# EAGLE schematic hw_DAA (EAGLE 7.6.0), part 1 of 4

## Sheet 1 of 34: Block Diagram
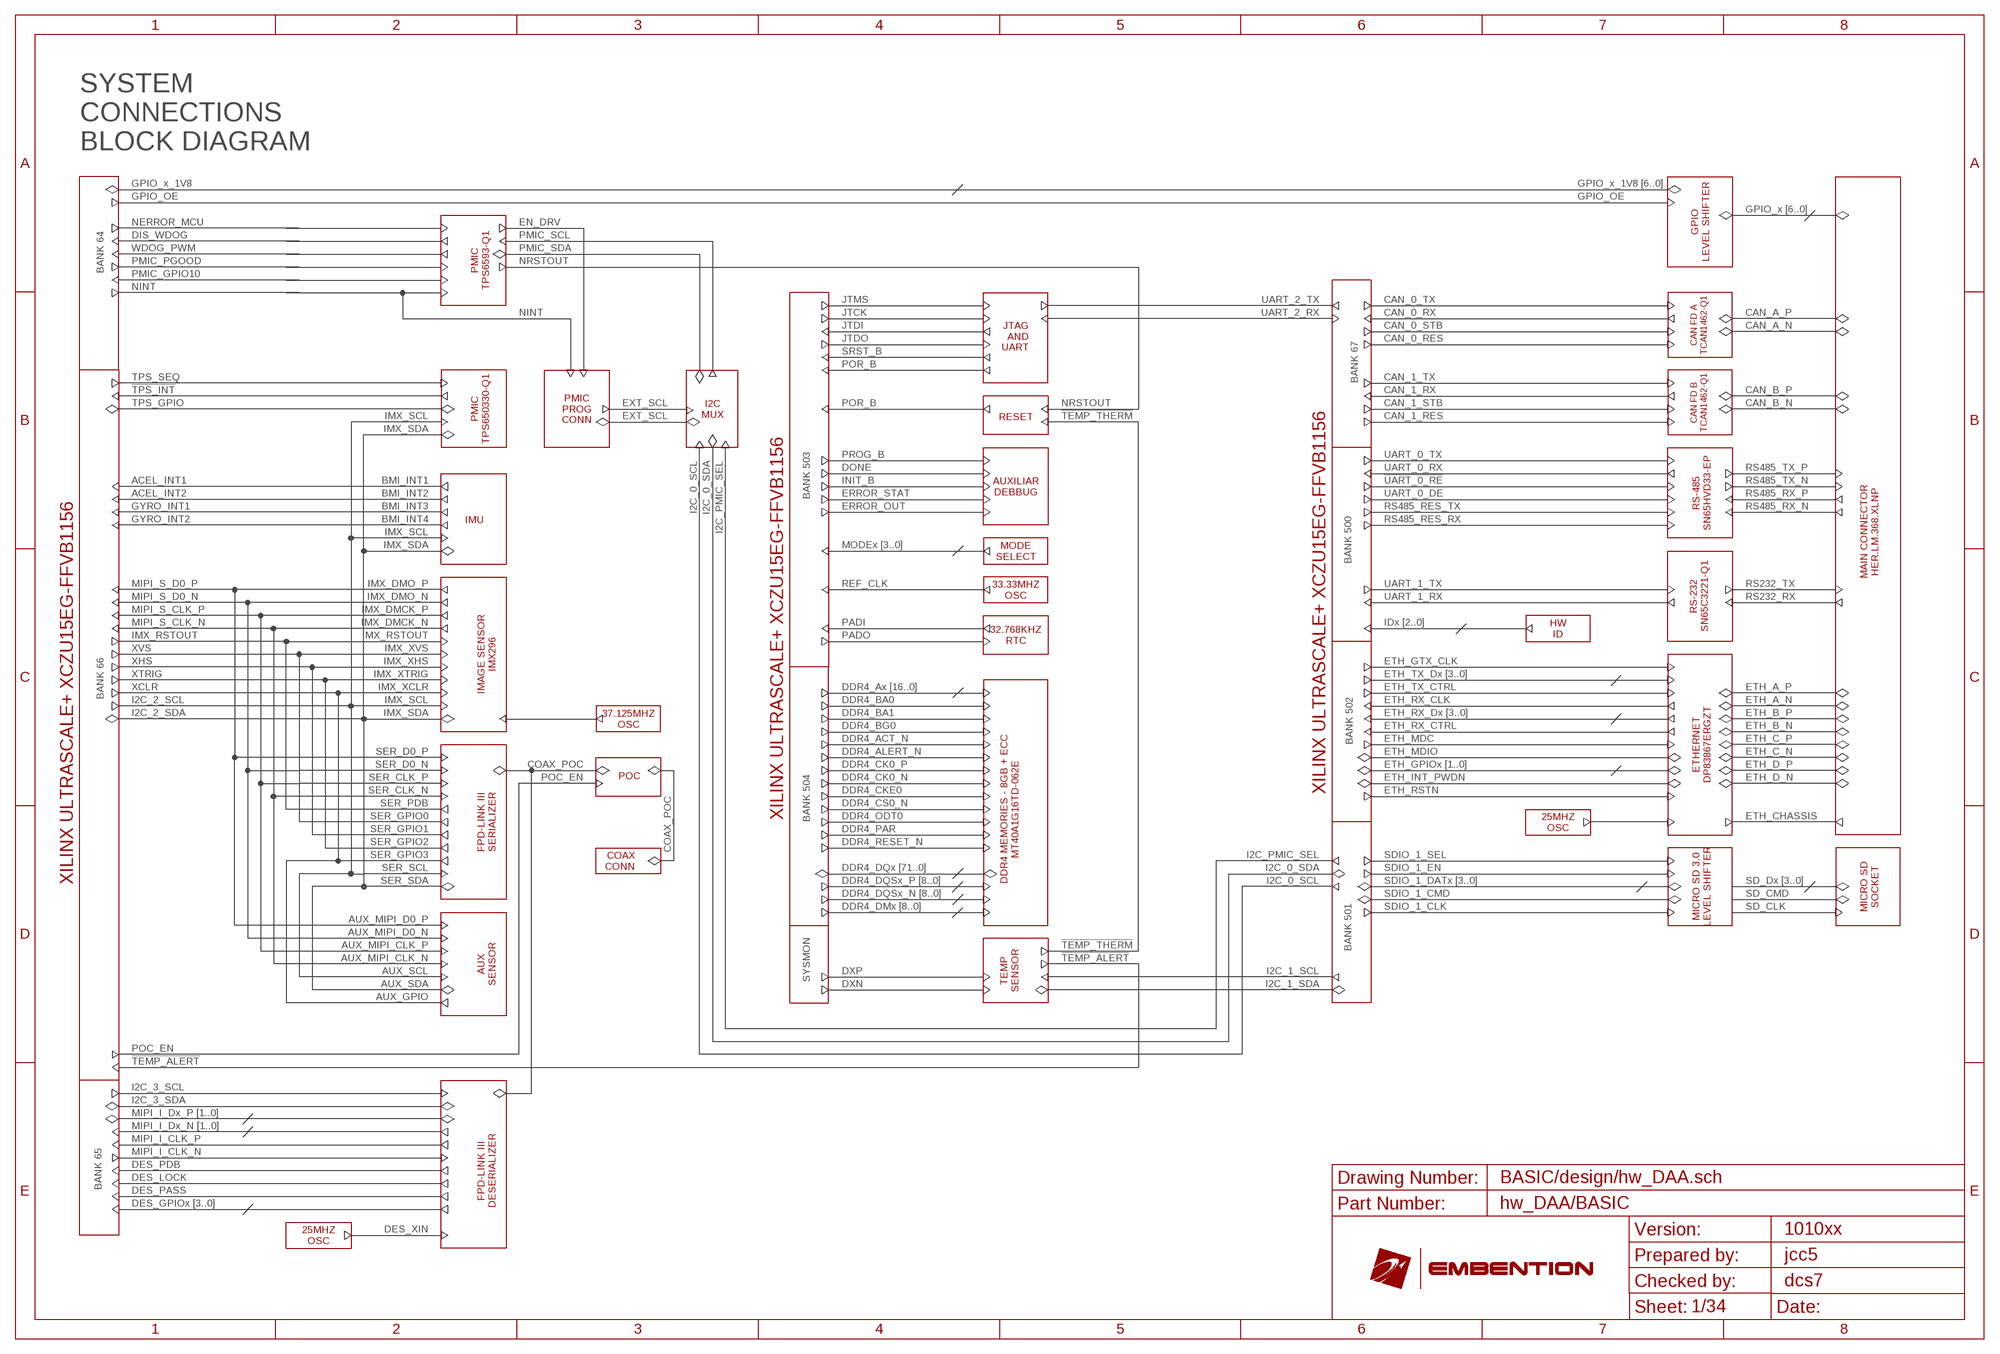
[diagram p0: schematic, sheet 1]

### Notes on the sheet
- SYSTEM
  CONNECTIONS
  BLOCK DIAGRAM
- GPIO_x_1V8 | GPIO_x_1V8 [6..0]
- GPIO_OE | GPIO_OE
- GPIO_x [6..0]
- GPIO
  LEVEL SHIFTER
- NERROR_MCU | EN_DRV
- DIS_WDOG | PMIC_SCL
- WDOG_PWM | PMIC_SDA
- PMIC
  TPS6593-Q1
- PMIC_PGOOD | NRSTOUT
- BANK 64
- PMIC_GPIO10
- NINT
- JTMS | UART_2_TX | CAN_0_TX
- NINT | JTCK | UART_2_RX | CAN_0_RX | CAN_A_P
- CAN FD A
  TCAN1462-Q1
- JTDI | CAN_0_STB | CAN_A_N
- JTDO | CAN_0_RES
- JTAG
  AND
  UART
- SRST_B
- POR_B
- TPS_SEQ | BANK 67 | CAN_1_TX
- !TPS_INT | CAN_1_RX | CAN_B_P
- CAN FD B
  TCAN1462-Q1
- TPS_GPIO | EXT_SCL | POR_B | NRSTOUT | CAN_1_STB | CAN_B_N
- PMIC
  TPS650330-Q1
- PMIC
  PROG
  CONN
- I2C
  MUX
- IMX_SCL | EXT_SCL | RESET | !TEMP_THERM | CAN_1_RES
- IMX_SDA
- I2C_0_SCL | I2C_0_SDA | I2C_PMIC_SEL | PROG_B | UART_0_TX
- DONE | UART_0_RX | RS485_TX_P
- ACEL_INT1 | BMI_INT1 | INIT_B | !UART_0_RE | RS485_TX_N
- AUXILIAR
  DEBBUG
- RS-485
  SN65HVD33-EP
- ACEL_INT2 | BMI_INT2 | BANK 503 | ERROR_STAT | UART_0_DE | RS485_RX_P
- GYRO_INT1 | BMI_INT3 | ERROR_OUT | RS485_RES_TX | RS485_RX_N
- IMU
- GYRO_INT2 | BMI_INT4 | RS485_RES_RX
- MAIN CONNECTOR
  HER.LM.368.XLNP
- IMX_SCL
- IMX_SDA | MODEx [3..0]
- MODE
  SELECT
- BANK 500
- MIPI_S_D0_P | IMX_DMO_P | REF_CLK | UART_1_TX | RS232_TX
- 33.33MHZ
  OSC
- RS-232
  SN65C3221-Q1
- MIPI_S_D0_N | IMX_DMO_N | XILINX ULTRASCALE+ XCZU15EG-FFVB1156 | UART_1_RX | RS232_RX
- MIPI_S_CLK_P | IMX_DMCK_P
- MIPI_S_CLK_N | IMX_DMCK_N | XILINX ULTRASCALE+ XCZU15EG-FFVB1156 | PADI | IDx [2..0]
- HW
  ID
- 32.768KHZ
  RTC
- IMX_RSTOUT | IMX_RSTOUT | PADO
- XVS | IMX_XVS
- IMAGE SENSOR
  IMX296
- XHS | IMX_XHS | ETH_GTX_CLK
- XTRIG | IMX_XTRIG | ETH_TX_Dx [3..0]
- XILINX ULTRASCALE+ XCZU15EG-FFVB1156 | XCLR | IMX_XCLR | DDR4_Ax [16..0] | ETH_TX_CTRL | ETH_A_P
- BANK 66
- I2C_2_SCL | IMX_SCL | DDR4_BA0 | ETH_RX_CLK | ETH_A_N
- I2C_2_SDA | IMX_SDA | DDR4_BA1 | ETH_RX_Dx [3..0] | ETH_B_P
- 37.125MHZ
  OSC
- DDR4_BG0 | ETH_RX_CTRL | ETH_B_N
- DDR4_ACT_N | BANK 502 | ETH_MDC | ETH_C_P
- ETHERNET
  DP83867ERGZT
- SER_D0_P | DDR4_ALERT_N | ETH_MDIO | ETH_C_N
- SER_D0_N | COAX_POC | DDR4_CK0_P | ETH_GPIOx [1..0] | ETH_D_P
- SER_CLK_P | POC_EN | POC | DDR4_CK0_N | ETH_INT_PWDN | ETH_D_N
- SER_CLK_N | COAX_POC | DDR4_CKE0 | ETH_RSTN
- SER_PDB | DDR4_CS0_N
- DDR4 MEMORIES - 8GB + ECC
  MT40A1G16TD-062E
- SER_GPIO0 | DDR4_ODT0 | ETH_CHASSIS
- FPD-LINK III
  SERIALIZER
- BANK 504
- 25MHZ
  OSC
- SER_GPIO1 | DDR4_PAR
- SER_GPIO2 | DDR4_RESET_N
- COAX
  CONN
- SER_GPIO3 | I2C_PMIC_SEL | SDIO_1_SEL
- SER_SCL | DDR4_DQx [71..0] | I2C_0_SDA | SDIO_1_EN
- SER_SDA | DDR4_DQSx_P [8..0] | I2C_0_SCL | SDIO_1_DATx [3..0] | SD_Dx [3..0]
- MICRO SD 3.0
  LEVEL SHIFTER
- MICRO SD
  SOCKET
- DDR4_DQSx_N [8..0] | SDIO_1_CMD | SD_CMD
- DDR4_DMx [8..0] | SDIO_1_CLK | SD_CLK
- AUX_MIPI_D0_P
- AUX_MIPI_D0_N
- AUX_MIPI_CLK_P | !TEMP_THERM | BANK 501
- AUX_MIPI_CLK_N | !TEMP_ALERT
- AUX
  SENSOR
- TEMP
  SENSOR
- AUX_SCL | DXP | I2C_1_SCL
- SYSMON
- AUX_SDA | DXN | I2C_1_SDA
- AUX_GPIO
- POC_EN
- !TEMP_ALERT
- I2C_3_SCL
- I2C_3_SDA
- MIPI_I_Dx_P [1..0]
- MIPI_I_Dx_N [1..0]
- MIPI_I_CLK_P
- MIPI_I_CLK_N
- DES_PDB
- FPD-LINK III
  DESERIALIZER
- DES_LOCK | BASIC/design/hw_DAA.sch
- BANK 65
- DES_PASS
- DES_GPIOx [3..0] | hw_DAA/BASIC
- DES_XIN
- 25MHZ
  OSC
- 1010xx
- jcc5
- dcs7

## Sheet 2 of 34: Connectors
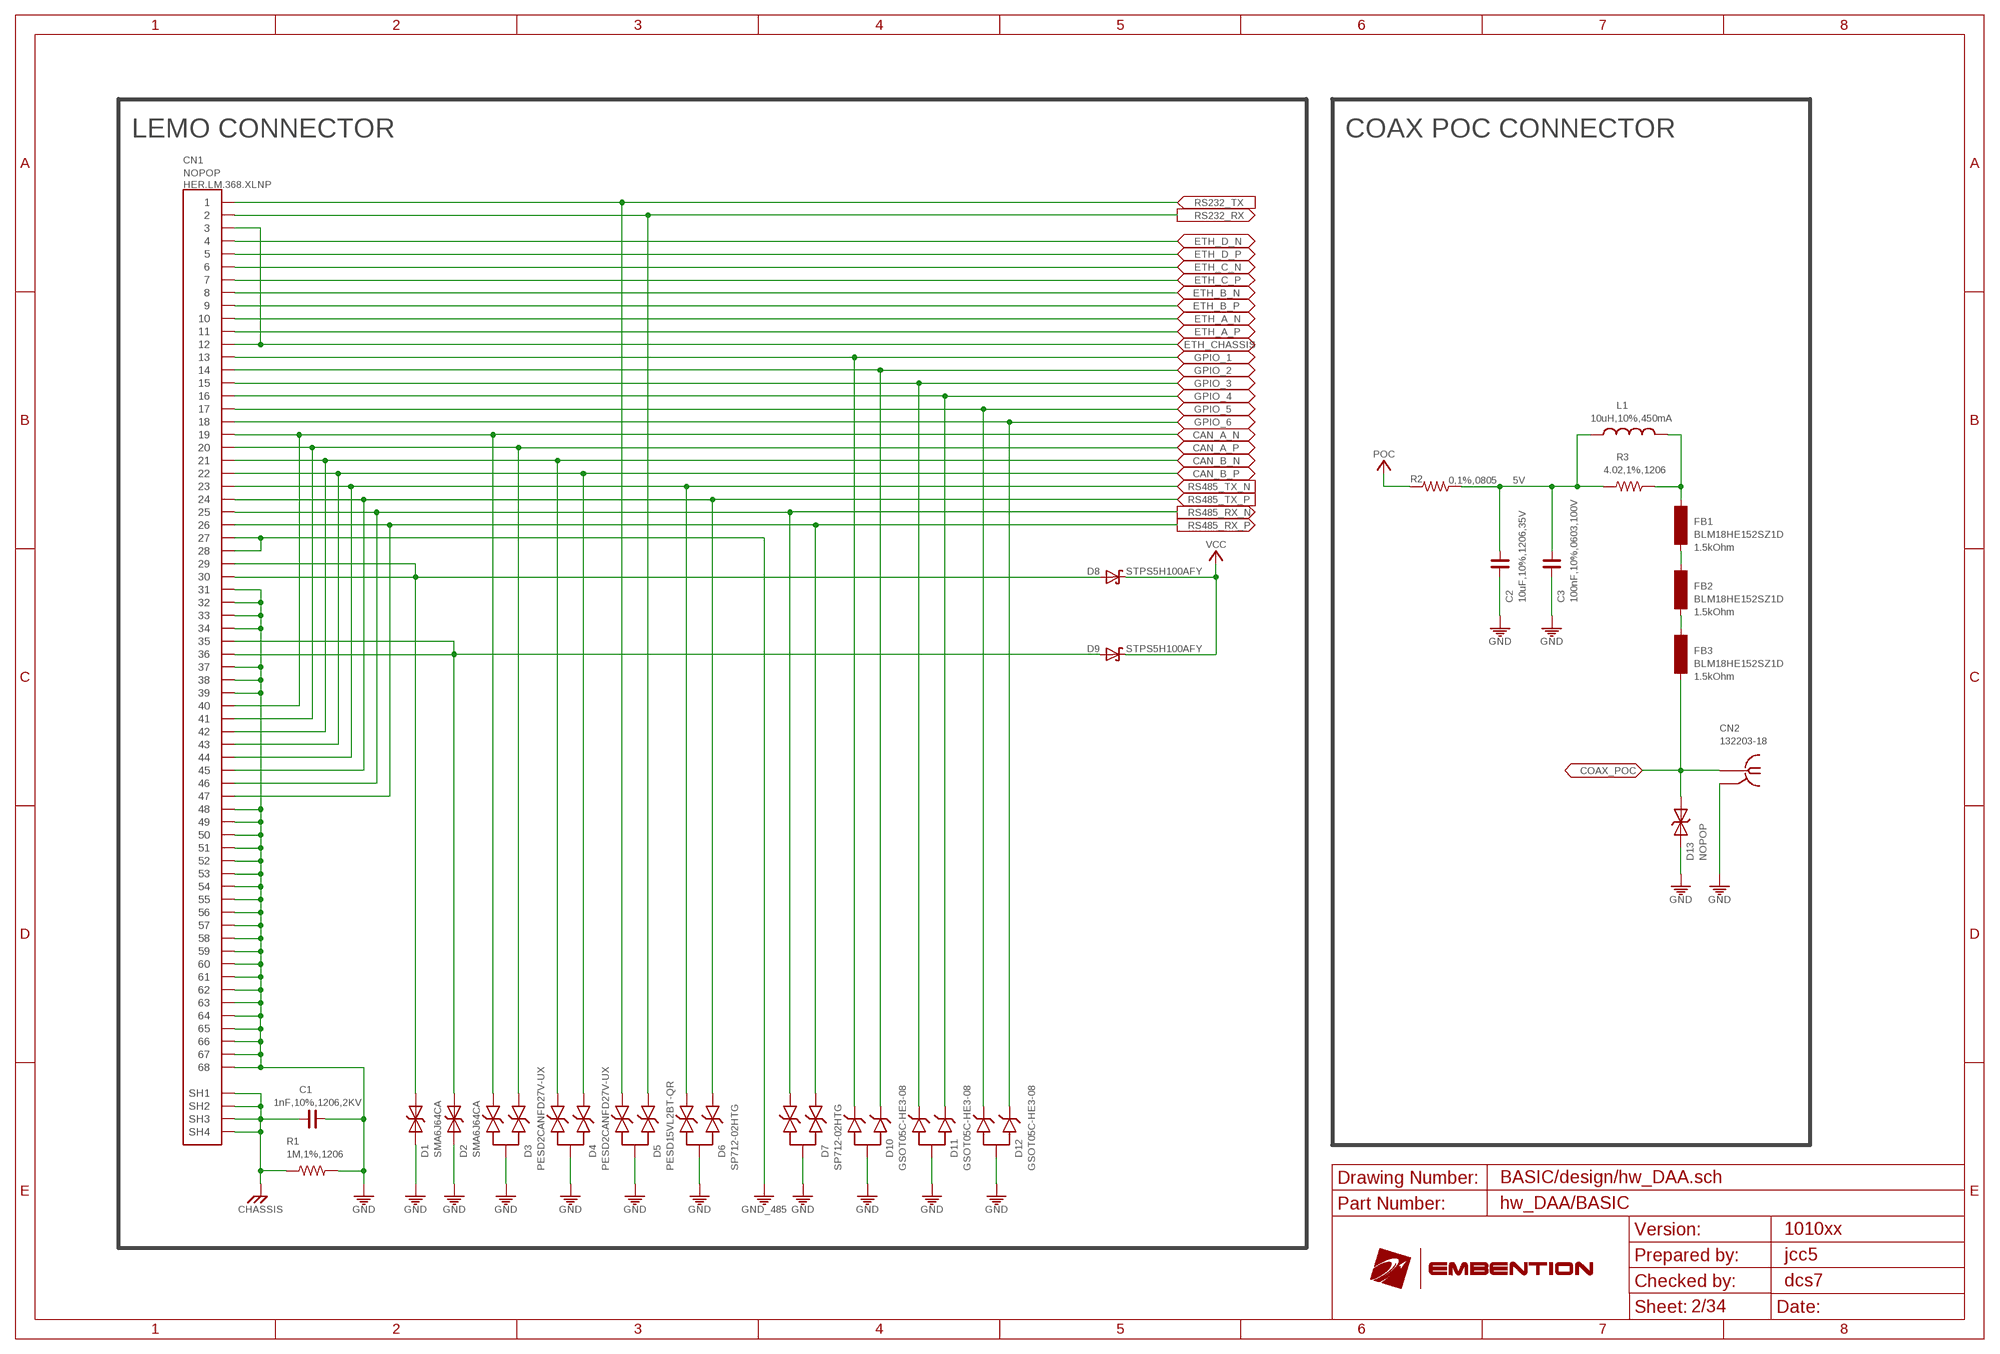
[diagram p1: schematic, sheet 2]

### Parts
C1  1nF,10%,1206,2KV  C_1206  [C1206]
C2  10uF,10%,1206,35V  C_1206  [C1206]
C3  100nF,10%,0603,100V  C_0603  [C0603]
CN1  NOPOP  HEW.LM.368.XLNP  [HEW.LM.368.XLNP]
CN2  132203-18  [132203-18]
D1  SMA6J64CA  SZ1SMA36CAT3G  [SMA_BI]
D2  SMA6J64CA  SZ1SMA36CAT3G  [SMA_BI]
D3  PESD2CANFD27V-UX  [SOT323-3]
D4  PESD2CANFD27V-UX  [SOT323-3]
D5  PESD15VL2BT-QR  SP712-02HTG  [SOT-23-3]
D6  SP712-02HTG  [SOT-23-3]
D7  SP712-02HTG  [SOT-23-3]
D8  STPS5H100AFY  PMEG10030ELPX  [SOD128]
D9  STPS5H100AFY  PMEG10030ELPX  [SOD128]
D10  GSOT05C-HE3-08  [SOT-23-3]
D11  GSOT05C-HE3-08  [SOT-23-3]
D12  GSOT05C-HE3-08  [SOT-23-3]
D13  NOPOP  PESD0402-140  [PESD0402-140]
FB1  BLM18HE152SZ1D  [L0603]
FB2  BLM18HE152SZ1D  [L0603]
FB3  BLM18HE152SZ1D  [L0603]
L1  10uH,10%,450mA  NLCV32T-100K-EFRD  [NLCV32T-100K-EFRD]
R1  1M,1%,1206  R_1206  [R1206]
R2  0,1%,0805  R_0805  [R0805]
R3  4.02,1%,1206  R_1206  [R1206]

### Nets
CAN_A_N [DIFF120]: CN1.19 CN1.40 D3.1 ; also sheet 25
CAN_A_P [DIFF120]: CN1.20 CN1.41 D3.2 ; also sheet 25
CAN_B_N [DIFF120]: CN1.21 CN1.42 D4.1 ; also sheet 25
CAN_B_P [DIFF120]: CN1.22 CN1.43 D4.2 ; also sheet 25
CHASSIS: C1.1 CN1.SH1 CN1.SH2 CN1.SH3 CN1.SH4 R1.1 ; also sheet 27
COAX_POC [COAX_50]: CN2.RF D13.P$2 FB3.1 ; also sheet 31,32
ETH_A_N [DIFF100]: CN1.10 ; also sheet 27
ETH_A_P [DIFF100]: CN1.11 ; also sheet 27
ETH_B_N [DIFF100]: CN1.8 ; also sheet 27
ETH_B_P [DIFF100]: CN1.9 ; also sheet 27
ETH_C_N [DIFF100]: CN1.6 ; also sheet 27
ETH_C_P [DIFF100]: CN1.7 ; also sheet 27
ETH_CHASSIS: CN1.3 CN1.12 ; also sheet 27
ETH_D_N [DIFF100]: CN1.4 ; also sheet 27
ETH_D_P [DIFF100]: CN1.5 ; also sheet 27
GND: C1.2 C2.1 C3.1 CN1.31 CN1.32 CN1.33 CN1.34 CN1.37 CN1.38 CN1.39 CN1.48 CN1.49 CN1.50 CN1.51 CN1.52 CN1.53 CN1.54 CN1.55 CN1.56 CN1.57 CN1.58 CN1.59 CN1.60 CN1.61 CN1.62 CN1.63 CN1.64 CN1.65 CN1.66 CN1.67 CN1.68 CN2.GND1(GND) CN2.GND2(GND) CN2.GND3(GND) CN2.GND4(GND) D1.1 D2.1 D3.3 D4.3 D5.3 D6.3 D7.3 D10.3 D11.3 D12.3 D13.P$1 R1.2 ; also sheet 3,4,5,6,7,8,9,10,11,12,13,14,15,17,18,20,21,22,23,24,25,26,27,28,29,30,31,32,33
GND_485: CN1.27 CN1.28 ; also sheet 26
GPIO_1: CN1.13 D10.1 ; also sheet 33
GPIO_2: CN1.14 D10.2 ; also sheet 33
GPIO_3: CN1.15 D11.1 ; also sheet 33
GPIO_4: CN1.16 D11.2 ; also sheet 33
GPIO_5: CN1.17 D12.1 ; also sheet 33
GPIO_6: CN1.18 D12.2 ; also sheet 33
N$57: C2.2 C3.2 L1.1 R2.1 R3.1
N$80: FB1.1 FB2.2
N$87: FB1.2 L1.2 R3.2
N$89: FB2.1 FB3.2
POC: R2.2 ; also sheet 3,9
RS232_RX: CN1.2 D5.2 ; also sheet 26
RS232_TX: CN1.1 D5.1 ; also sheet 26
RS485_RX_N [DIFF120]: CN1.25 CN1.46 D7.1 ; also sheet 26
RS485_RX_P [DIFF120]: CN1.26 CN1.47 D7.2 ; also sheet 26
RS485_TX_N [DIFF120]: CN1.23 CN1.44 D6.1 ; also sheet 26
RS485_TX_P [DIFF120]: CN1.24 CN1.45 D6.2 ; also sheet 26
VCC: D8.K(C) D9.K(C) ; also sheet 3
VIN_1: CN1.29 CN1.30 D1.2 D8.A
VIN_2: CN1.35 CN1.36 D2.2 D9.A

### Notes on the sheet
- LEMO CONNECTOR | COAX POC CONNECTOR
- HER.LM.368.XLNP
- 5V
- 1.5kOhm
- 1.5kOhm
- 1.5kOhm
- BASIC/design/hw_DAA.sch
- hw_DAA/BASIC
- 1010xx
- jcc5
- dcs7

## Sheet 3 of 34: +5V Power Supply
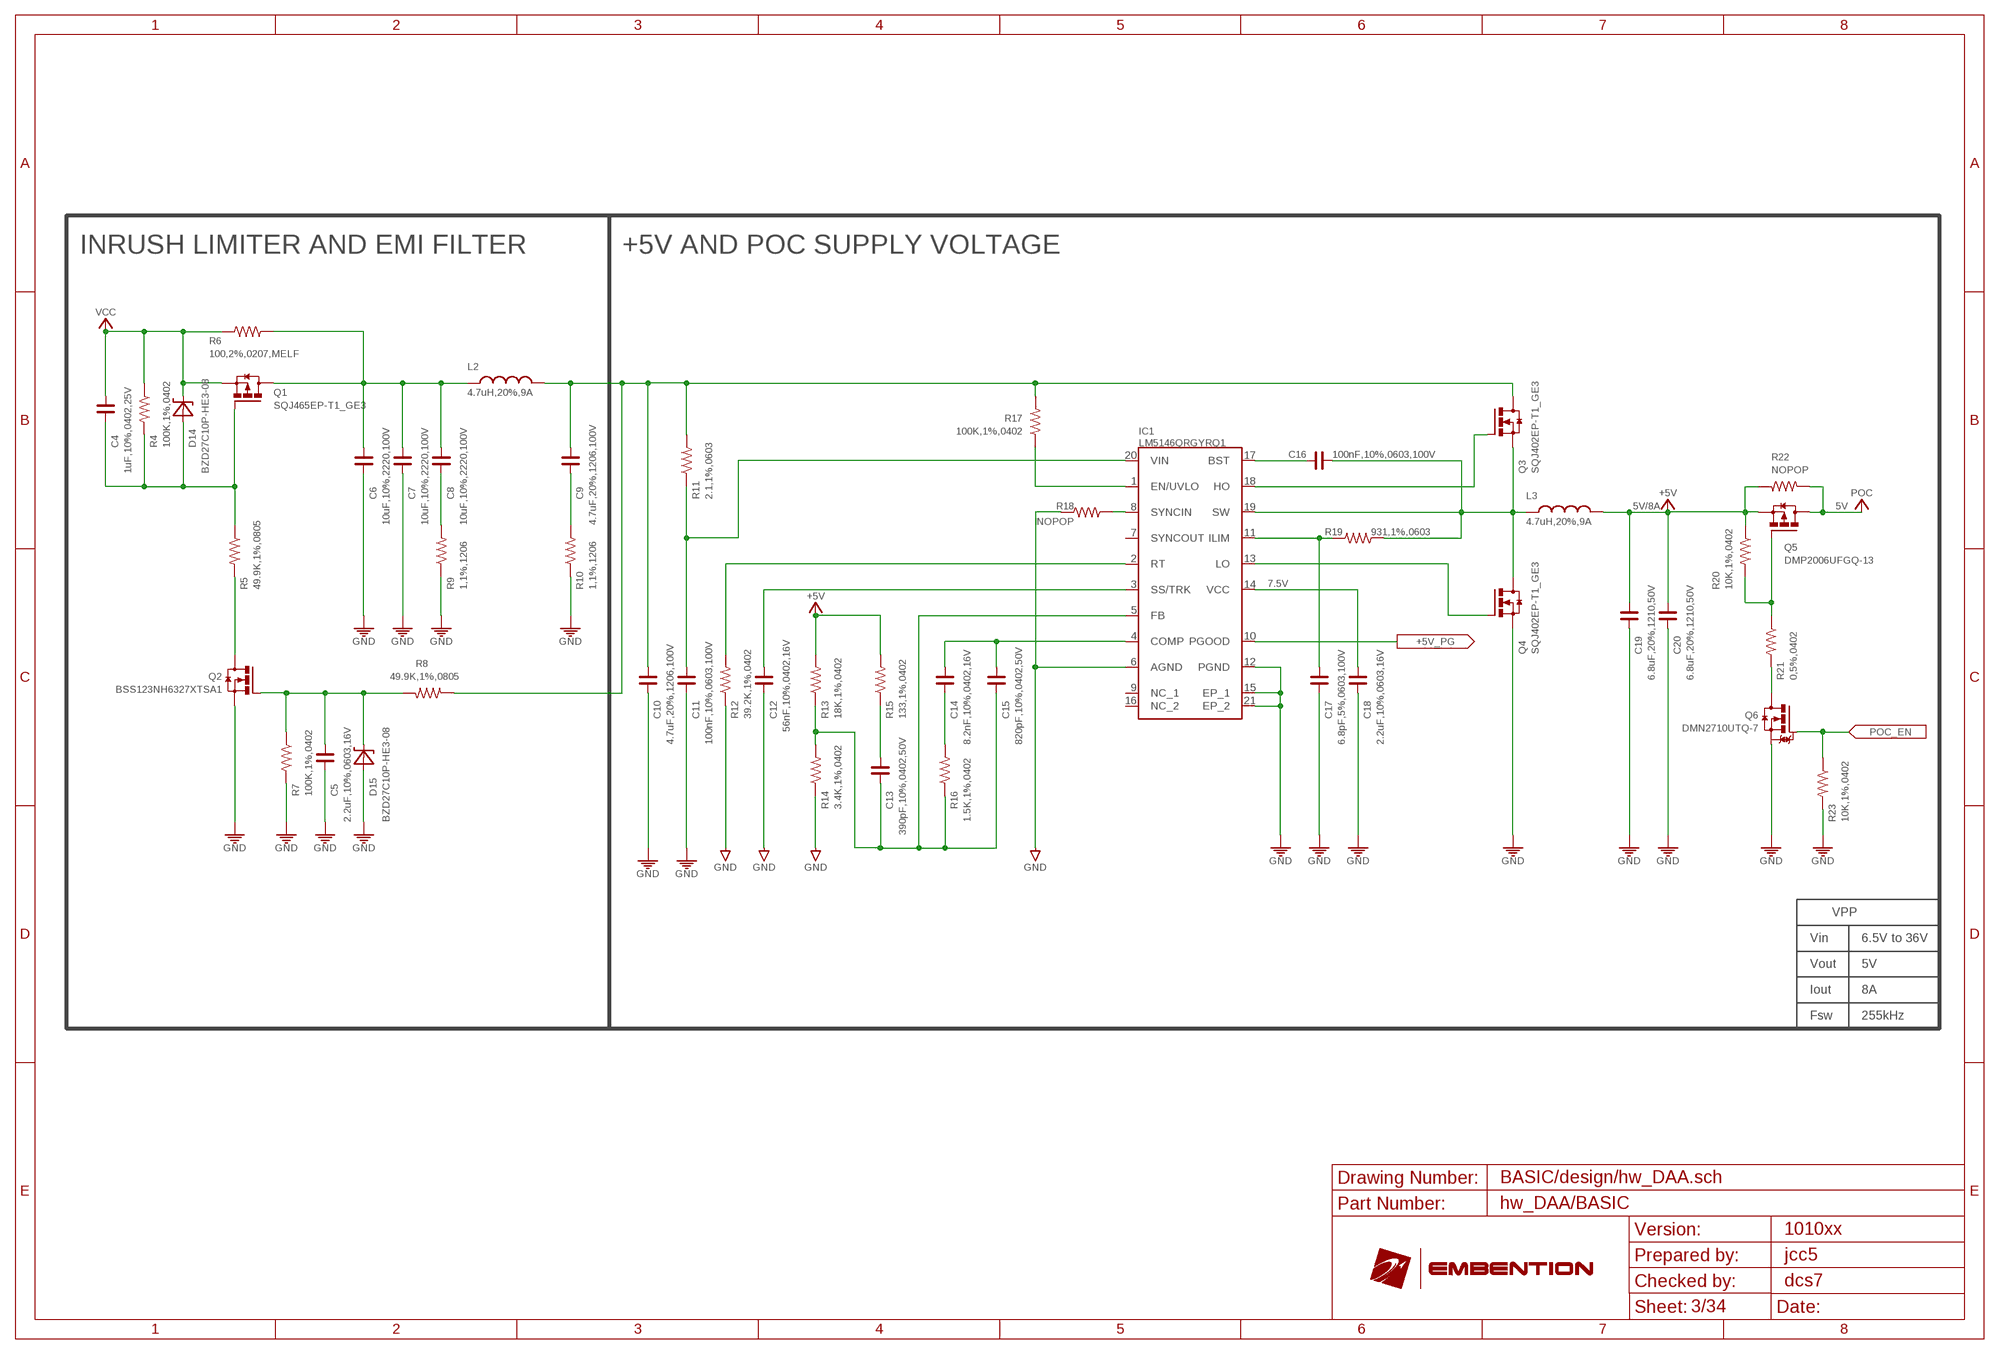
[diagram p2: schematic, sheet 3]

### Parts
C4  1uF,10%,0402,25V  C_0402  [C0402]
C5  2.2uF,10%,0603,16V  C_0603  [C0603]
C6  10uF,10%,2220,100V  C_2220K  [C2220K]
C7  10uF,10%,2220,100V  C_2220K  [C2220K]
C8  10uF,10%,2220,100V  C_2220K  [C2220K]
C9  4.7uF,20%,1206,100V  C_1206  [C1206]
C10  4.7uF,20%,1206,100V  C_1206  [C1206]
C11  100nF,10%,0603,100V  C_0603  [C0603]
C12  56nF,10%,0402,16V  C_0402  [C0402]
C13  390pF,10%,0402,50V  C_0402  [C0402]
C14  8.2nF,10%,0402,16V  C_0402  [C0402]
C15  820pF,10%,0402,50V  C_0402  [C0402]
C16  100nF,10%,0603,100V  C_0603  [C0603]
C17  6.8pF,5%,0603,100V  C_0603  [C0603]
C18  2.2uF,10%,0603,16V  C_0603  [C0603]
C19  6.8uF,20%,1210,50V  C_1210  [C1210]
C20  6.8uF,20%,1210,50V  C_1210  [C1210]
D14  BZD27C10P-HE3-08  [DO-219AB-2]
D15  BZD27C10P-HE3-08  [DO-219AB-2]
IC1  LM5146QRGYRQ1  LM5146-Q1  [VQFN-20]
L2  4.7uH,20%,9A  XAL7030472  [XAL7030-472]
L3  4.7uH,20%,9A  XAL7030472  [XAL7030-472]
Q1  SQJ465EP-T1_GE3  [SO-8L]
Q2  BSS123NH6327XTSA1  [SOT23-3]
Q3  SQJ402EP-T1_GE3  [SO-8L]
Q4  SQJ402EP-T1_GE3  [SO-8L]
Q5  DMP2006UFGQ-13  [POWERDI3333-8]
Q6  DMN2710UTQ-7  [SOT-523]
R4  100K,1%,0402  R_0402  [R0402]
R5  49.9K,1%,0805  R_0805  [R0805]
R6  100,2%,0207,MELF  R_0207  [MELF0207]
R7  100K,1%,0402  R_0402  [R0402]
R8  49.9K,1%,0805  R_0805  [R0805]
R9  1,1%,1206  R_1206  [R1206]
R10  1,1%,1206  R_1206  [R1206]
R11  2.1,1%,0603  R_0603  [R0603]
R12  39.2K,1%,0402  R_0402  [R0402]
R13  18K,1%,0402  R_0402  [R0402]
R14  3.4K,1%,0402  R_0402  [R0402]
R15  133,1%,0402  R_0402  [R0402]
R16  1.5K,1%,0402  R_0402  [R0402]
R17  100K,1%,0402  R_0402  [R0402]
R18  NOPOP  R_0402  [R0402]
R19  931,1%,0603  R_0603  [R0603]
R20  10K,1%,0402  R_0402  [R0402]
R21  0,5%,0402  R_0402  [R0402]
R22  NOPOP  R_0805  [R0805]
R23  10K,1%,0402  R_0402  [R0402]

### Nets
+5V: C19.1 C20.1 L3.2 Q5.1(S) Q5.2(S) Q5.3(S) R13.2 R15.2 R20.1 R22.1 ; also sheet 4,5,7,8,25,26,33
+5V_PG: IC1.10(PGOOD) ; also sheet 4
GND: C5.2 C6.2 C7.2 C10.2 C11.2 C12.2 C17.2 C18.2 C19.2 C20.2 D15.A IC1.6(AGND) IC1.12(PGND) IC1.15(EP_1) IC1.21(EP_2) Q2.2(S) Q4.1(S) Q4.2(S) Q4.3(S) Q6.2(S) R7.2 R9.1 R10.1 R12.1 R14.1 R18.1 R23.2 ; also sheet 2,4,5,6,7,8,9,10,11,12,13,14,15,17,18,20,21,22,23,24,25,26,27,28,29,30,31,32,33
HO: IC1.18(HO) Q3.4(G)
ILIM: C17.1 IC1.11(ILIM) R19.2
LO: IC1.13(LO) Q4.4(G)
N$2: Q5.4(G) R20.2 R21.1
N$43: IC1.2(RT) R12.2
N$45: C12.1 IC1.3(SS/TRK)
N$46: C13.2 C15.2 IC1.5(FB) R13.1 R14.2 R16.1
N$49: C14.2 R16.2
N$50: C16.1 IC1.19(SW) L3.1 Q3.1(S) Q3.2(S) Q3.3(S) Q4.5(D) Q4.EP1(D) Q4.EP2(D) R19.1
N$51: C16.2 IC1.17(BST)
N$52: C9.1 C10.1 L2.2 Q3.5(D) Q3.EP1(D) Q3.EP2(D) R8.1 R11.2 R17.2
N$60: C8.2 R9.2
N$61: C9.2 R10.2
N$63: C18.1 IC1.14(VCC)
N$64: IC1.1(EN/UVLO) R17.1
N$65: IC1.8(SYNCIN) R18.2
N$66: C13.1 R15.1
N$69: C11.1 IC1.20(VIN) R11.1
N$70: C4.2 D14.A Q1.4(G) R4.2 R5.1
N$83: C6.1 C7.1 C8.1 L2.1 Q1.5(D) Q1.EP1(D) Q1.EP2(D) R6.2
N$110: C14.1 C15.1 IC1.4(COMP)
N$118: Q6.3(D) R21.2
N$173: Q2.3(D) R5.2
N$175: C5.1 D15.K(C) Q2.1(G) R7.1 R8.2
POC: Q5.5(D) Q5.6(D) Q5.7(D) Q5.8(D) Q5.EP(D) R22.2 ; also sheet 2,9
POC_EN: Q6.1(G) R23.1 ; also sheet 17
VCC: C4.1 D14.K(C) Q1.1(S) Q1.2(S) Q1.3(S) R4.1 R6.1 ; also sheet 2
Unconnected: IC1.7(SYNCOUT) IC1.9(NC_1) IC1.16(NC_2)

### Notes on the sheet
- INRUSH LIMITER AND EMI FILTER | +5V AND POC SUPPLY VOLTAGE
- 5V/8A | 5V
- 7.5V
- VPP
- Vin | 6.5V to 36V
- Vout | 5V
- Iout | 8A
- Fsw | 255kHz
- BASIC/design/hw_DAA.sch
- hw_DAA/BASIC
- 1010xx
- jcc5
- dcs7

## Sheet 4 of 34: VMON Buck
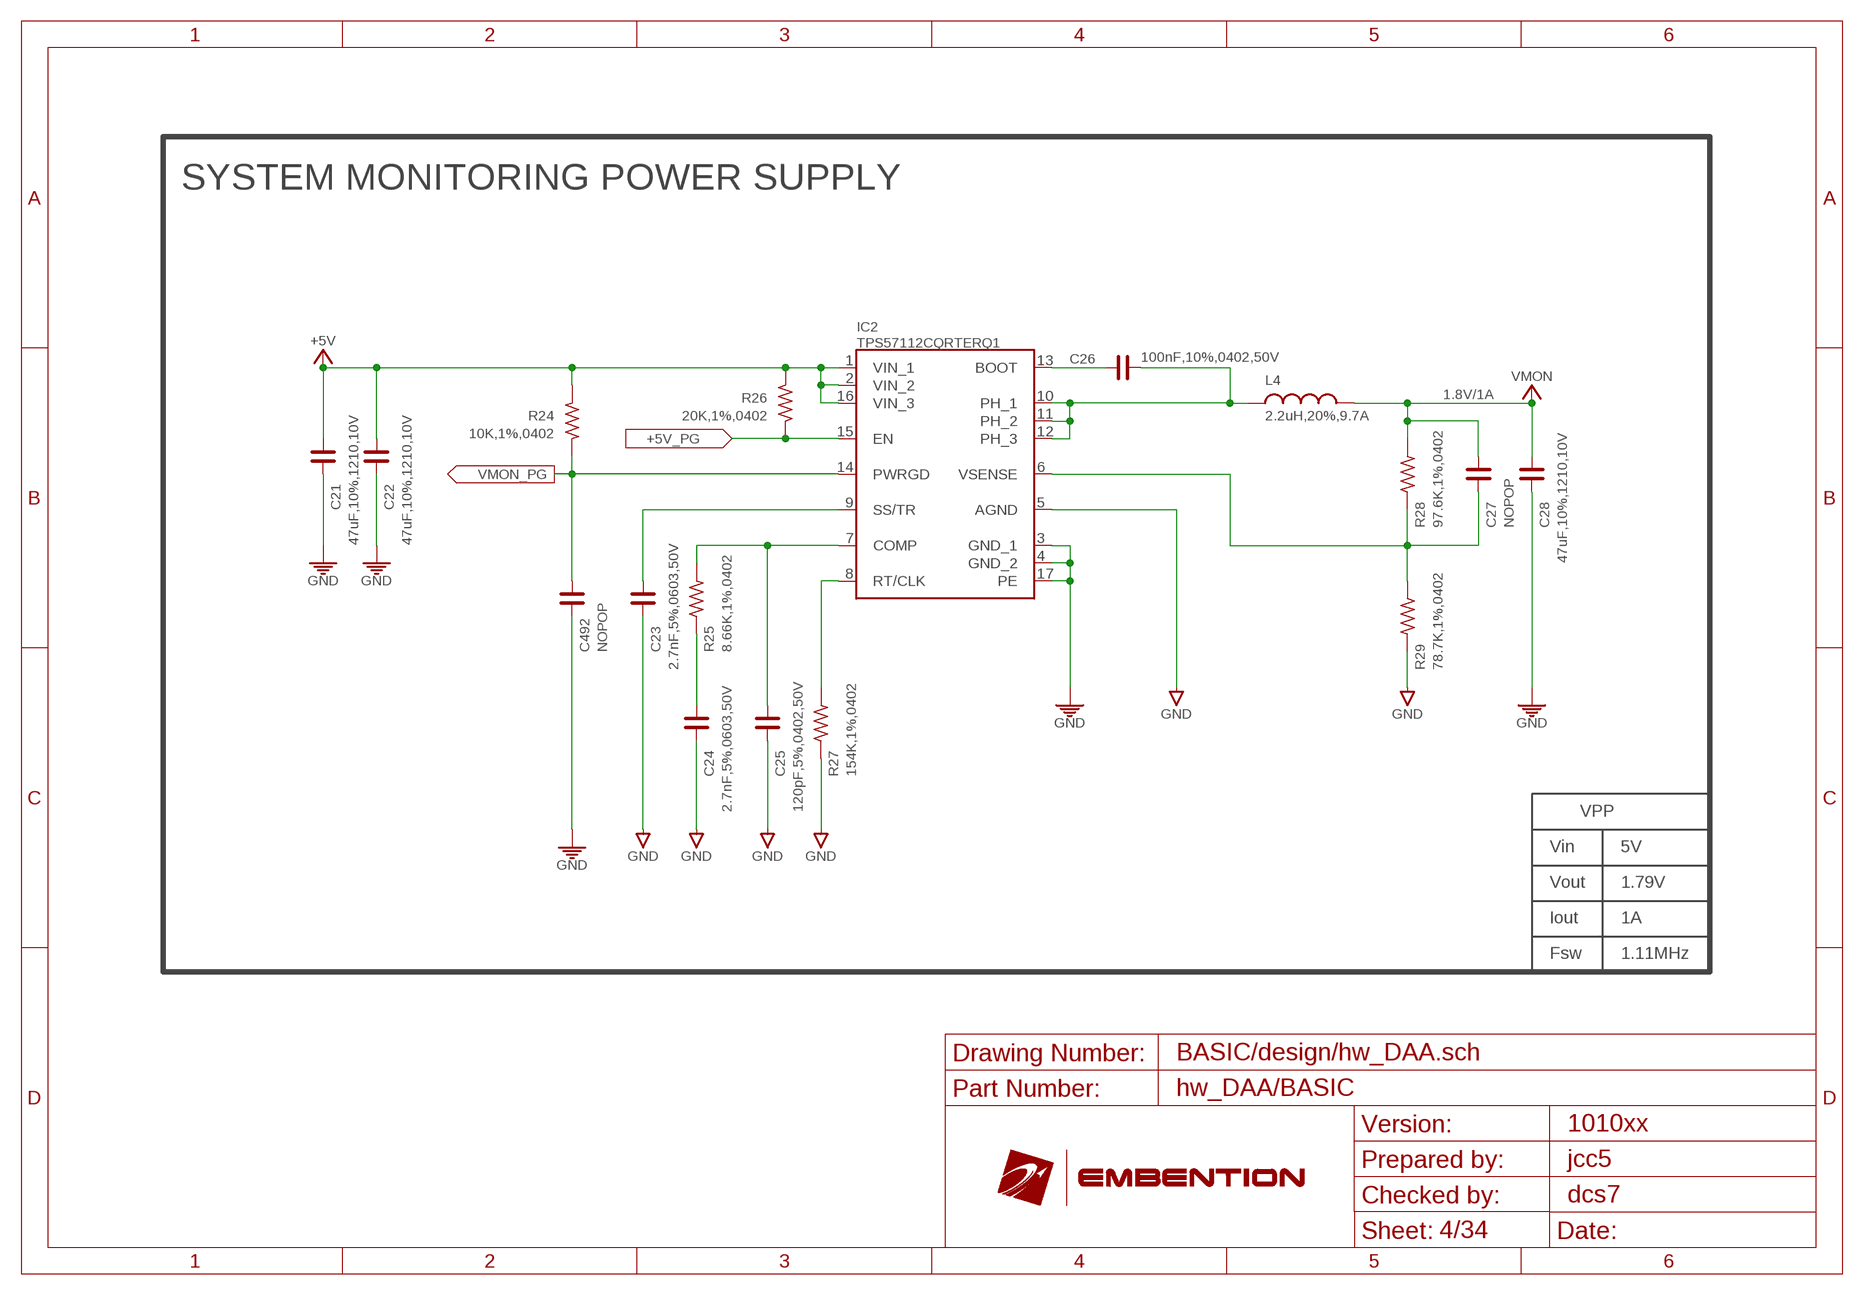
[diagram p3: schematic, sheet 4]

### Parts
C21  47uF,10%,1210,10V  C_1210  [C1210]
C22  47uF,10%,1210,10V  C_1210  [C1210]
C23  2.7nF,5%,0603,50V  C_0603  [C0603]
C24  2.7nF,5%,0603,50V  C_0603  [C0603]
C25  120pF,5%,0402,50V  C_0402  [C0402]
C26  100nF,10%,0402,50V  C_0402  [C0402]
C27  NOPOP  C_0402  [C0402]
C28  47uF,10%,1210,10V  C_1210  [C1210]
C492  NOPOP  C_0402  [C0402]
IC2  TPS57112CQRTERQ1  TPS57112C-Q1  [WQFN-16]
L4  2.2uH,20%,9.7A  XAL50XX  [XAL50XX]
R24  10K,1%,0402  R_0402  [R0402]
R25  8.66K,1%,0402  R_0402  [R0402]
R26  20K,1%,0402  R_0402  [R0402]
R27  154K,1%,0402  R_0402  [R0402]
R28  97.6K,1%,0402  R_0402  [R0402]
R29  78.7K,1%,0402  R_0402  [R0402]

### Nets
+5V: C21.1 C22.1 IC2.1(VIN_1) IC2.2(VIN_2) IC2.16(VIN_3) R24.2 R26.2 ; also sheet 3,5,7,8,25,26,33
+5V_PG: IC2.15(EN) R26.1 ; also sheet 3
GND: C21.2 C22.2 C23.2 C24.2 C25.2 C28.2 C492.2 IC2.3(GND_1) IC2.4(GND_2) IC2.5(AGND) IC2.17(PE) R27.1 R29.1 ; also sheet 2,3,5,6,7,8,9,10,11,12,13,14,15,17,18,20,21,22,23,24,25,26,27,28,29,30,31,32,33
N$77: C23.1 IC2.9(SS/TR)
N$81: C25.1 IC2.7(COMP) R25.2
N$133: C24.1 R25.1
N$135: IC2.8(RT/CLK) R27.2
N$136: C27.2 IC2.6(VSENSE) R28.1 R29.2
N$137: C26.2 IC2.13(BOOT)
N$138: C26.1 IC2.10(PH_1) IC2.11(PH_2) IC2.12(PH_3) L4.1
VMON: C27.1 C28.1 L4.2 R28.2 ; also sheet 5,6,7,8,10
VMON_PG: C492.1 IC2.14(PWRGD) R24.1 ; also sheet 5

### Notes on the sheet
- SYSTEM MONITORING POWER SUPPLY
- 1.8V/1A
- VPP
- Vin | 5V
- Vout | 1.79V
- Iout | 1A
- Fsw | 1.11MHz
- BASIC/design/hw_DAA.sch
- hw_DAA/BASIC
- 1010xx
- jcc5
- dcs7

## Sheet 5 of 34: FPGA and Peripherals PMIC
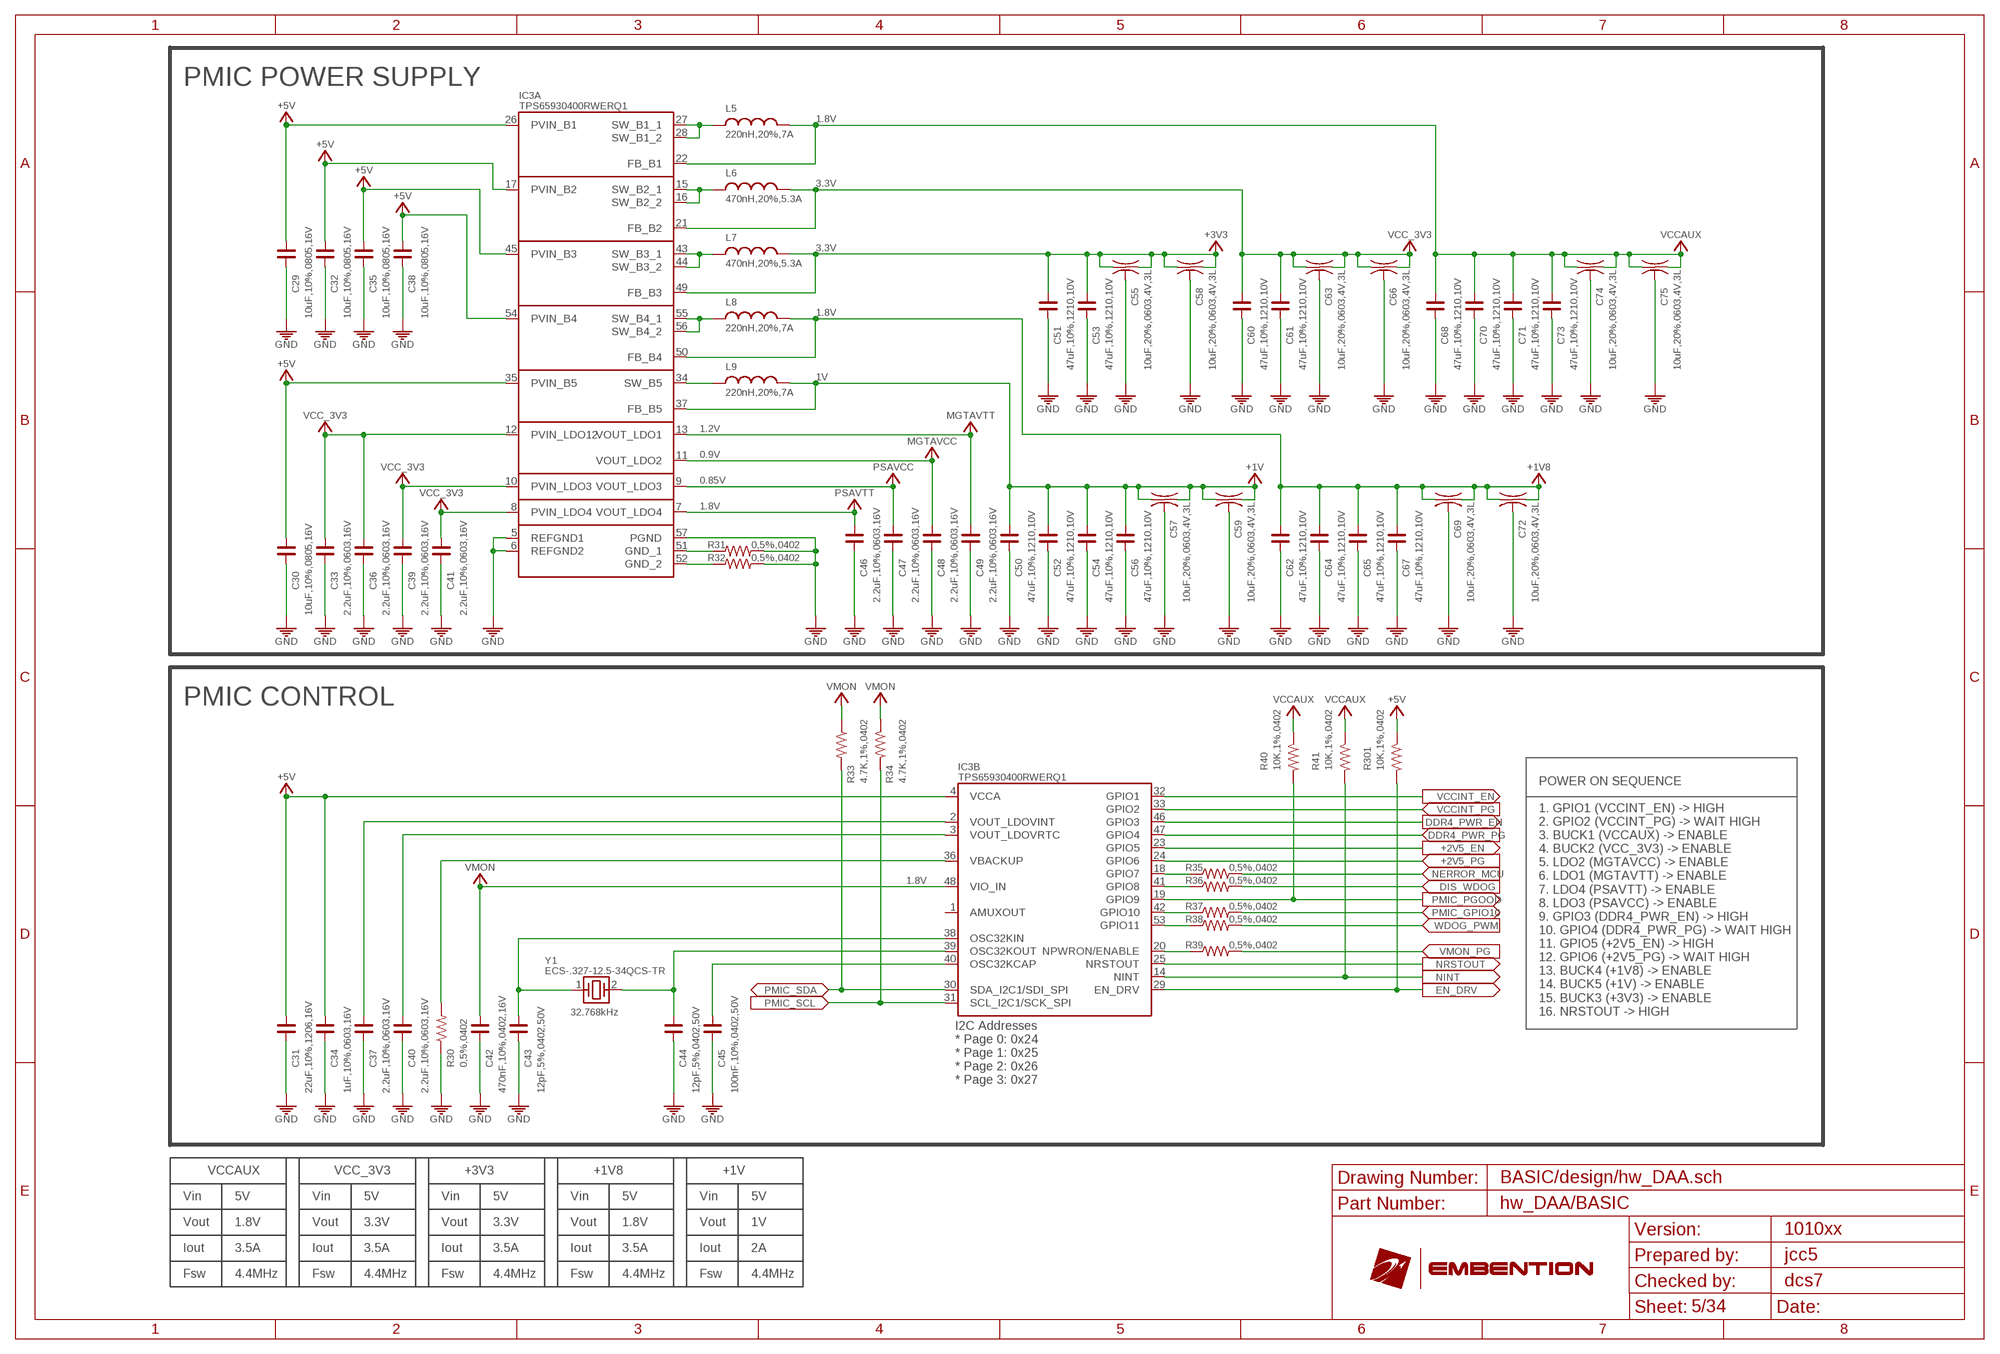
[diagram p4: schematic, sheet 5]

### Parts
C29  10uF,10%,0805,16V  C_0805  [C0805]
C30  10uF,10%,0805,16V  C_0805  [C0805]
C31  22uF,10%,1206,16V  C_1206  [C1206]
C32  10uF,10%,0805,16V  C_0805  [C0805]
C33  2.2uF,10%,0603,16V  C_0603  [C0603]
C34  1uF,10%,0603,16V  C_0603  [C0603]
C35  10uF,10%,0805,16V  C_0805  [C0805]
C36  2.2uF,10%,0603,16V  C_0603  [C0603]
C37  2.2uF,10%,0603,16V  C_0603  [C0603]
C38  10uF,10%,0805,16V  C_0805  [C0805]
C39  2.2uF,10%,0603,16V  C_0603  [C0603]
C40  2.2uF,10%,0603,16V  C_0603  [C0603]
C41  2.2uF,10%,0603,16V  C_0603  [C0603]
C42  470nF,10%,0402,16V  C_0402  [C0402]
C43  12pF,5%,0402,50V  C_0402  [C0402]
C44  12pF,5%,0402,50V  C_0402  [C0402]
C45  100nF,10%,0402,50V  C_0402  [C0402]
C46  2.2uF,10%,0603,16V  C_0603  [C0603]
C47  2.2uF,10%,0603,16V  C_0603  [C0603]
C48  2.2uF,10%,0603,16V  C_0603  [C0603]
C49  2.2uF,10%,0603,16V  C_0603  [C0603]
C50  47uF,10%,1210,10V  C_1210  [C1210]
C51  47uF,10%,1210,10V  C_1210  [C1210]
C52  47uF,10%,1210,10V  C_1210  [C1210]
C53  47uF,10%,1210,10V  C_1210  [C1210]
C54  47uF,10%,1210,10V  C_1210  [C1210]
C55  10uF,20%,0603,4V,3L  NFM18HC106D0G3L  [NFM18HC106]
C56  47uF,10%,1210,10V  C_1210  [C1210]
C57  10uF,20%,0603,4V,3L  NFM18HC106D0G3L  [NFM18HC106]
C58  10uF,20%,0603,4V,3L  NFM18HC106D0G3L  [NFM18HC106]
C59  10uF,20%,0603,4V,3L  NFM18HC106D0G3L  [NFM18HC106]
C60  47uF,10%,1210,10V  C_1210  [C1210]
C61  47uF,10%,1210,10V  C_1210  [C1210]
C62  47uF,10%,1210,10V  C_1210  [C1210]
C63  10uF,20%,0603,4V,3L  NFM18HC106D0G3L  [NFM18HC106]
C64  47uF,10%,1210,10V  C_1210  [C1210]
C65  47uF,10%,1210,10V  C_1210  [C1210]
C66  10uF,20%,0603,4V,3L  NFM18HC106D0G3L  [NFM18HC106]
C67  47uF,10%,1210,10V  C_1210  [C1210]
C68  47uF,10%,1210,10V  C_1210  [C1210]
C69  10uF,20%,0603,4V,3L  NFM18HC106D0G3L  [NFM18HC106]
C70  47uF,10%,1210,10V  C_1210  [C1210]
C71  47uF,10%,1210,10V  C_1210  [C1210]
C72  10uF,20%,0603,4V,3L  NFM18HC106D0G3L  [NFM18HC106]
C73  47uF,10%,1210,10V  C_1210  [C1210]
C74  10uF,20%,0603,4V,3L  NFM18HC106D0G3L  [NFM18HC106]
C75  10uF,20%,0603,4V,3L  NFM18HC106D0G3L  [NFM18HC106]
IC3  TPS65930400RWERQ1  TPS6593-Q1  [VQFN-56]
L5  220nH,20%,7A  TFM322512ALMA  [L1210]
L6  470nH,20%,5.3A  TFM322512ALMA  [L1210]
L7  470nH,20%,5.3A  TFM322512ALMA  [L1210]
L8  220nH,20%,7A  TFM322512ALMA  [L1210]
L9  220nH,20%,7A  TFM322512ALMA  [L1210]
R30  0,5%,0402  R_0402  [R0402]
R31  0,5%,0402  R_0402  [R0402]
R32  0,5%,0402  R_0402  [R0402]
R33  4.7K,1%,0402  R_0402  [R0402]
R34  4.7K,1%,0402  R_0402  [R0402]
R35  0,5%,0402  R_0402  [R0402]
R36  0,5%,0402  R_0402  [R0402]
R37  0,5%,0402  R_0402  [R0402]
R38  0,5%,0402  R_0402  [R0402]
R39  0,5%,0402  R_0402  [R0402]
R40  10K,1%,0402  R_0402  [R0402]
R41  10K,1%,0402  R_0402  [R0402]
R301  10K,1%,0402  R_0402  [R0402]
Y1  ECS-.327-12.5-34QCS-TR  [3.2X1.5]

### Nets
+1V: C50.1 C52.1 C54.1 C56.1 C57.1 C57.3 C59.1 C59.3 IC3.37(A:FB_B5) L9.2 ; also sheet 27
+1V8: C62.1 C64.1 C65.1 C67.1 C69.1 C69.3 C72.1 C72.3 IC3.50(A:FB_B4) L8.2 ; also sheet 24,27,33
+2V5_EN: IC3.23(B:GPIO5) ; also sheet 10
+2V5_PG: IC3.24(B:GPIO6) ; also sheet 10
+3V3: C51.1 C53.1 C55.1 C55.3 C58.1 C58.3 IC3.49(A:FB_B3) L7.2 ; also sheet 10,24,25,26
+5V: C29.1 C30.1 C31.1 C32.1 C34.1 C35.1 C38.1 IC3.4(B:VCCA) IC3.17(A:PVIN_B2) IC3.26(A:PVIN_B1) IC3.35(A:PVIN_B5) IC3.45(A:PVIN_B3) IC3.54(A:PVIN_B4) R301.1 ; also sheet 3,4,7,8,25,26,33
DDR4_PWR_EN: IC3.46(B:GPIO3) ; also sheet 8
DDR4_PWR_PG: IC3.47(B:GPIO4) ; also sheet 8,10
DIS_WDOG: R36.2 ; also sheet 17
EN_DRV: IC3.29(B:EN_DRV) R301.2 ; also sheet 6
GND: C29.2 C30.2 C31.2 C32.2 C33.2 C34.2 C35.2 C36.2 C37.2 C38.2 C39.2 C40.2 C41.2 C42.2 C43.2 C44.2 C45.2 C46.2 C47.2 C48.2 C49.2 C50.2 C51.2 C52.2 C53.2 C54.2 C55.2 C55.4 C56.2 C57.2 C57.4 C58.2 C58.4 C59.2 C59.4 C60.2 C61.2 C62.2 C63.2 C63.4 C64.2 C65.2 C66.2 C66.4 C67.2 C68.2 C69.2 C69.4 C70.2 C71.2 C72.2 C72.4 C73.2 C74.2 C74.4 C75.2 C75.4 IC3.5(A:REFGND1) IC3.6(A:REFGND2) IC3.57(A:PGND) R30.1 R31.2 R32.2 ; also sheet 2,3,4,6,7,8,9,10,11,12,13,14,15,17,18,20,21,22,23,24,25,26,27,28,29,30,31,32,33
MGTAVCC: C48.1 IC3.11(A:VOUT_LDO2) ; also sheet 11
MGTAVTT: C49.1 IC3.13(A:VOUT_LDO1) ; also sheet 11,12
N$19: IC3.27(A:SW_B1_1) IC3.28(A:SW_B1_2) L5.1
N$114: IC3.43(A:SW_B3_1) IC3.44(A:SW_B3_2) L7.1
N$117: IC3.55(A:SW_B4_1) IC3.56(A:SW_B4_2) L8.1
N$119: IC3.34(A:SW_B5) L9.1
N$121: IC3.15(A:SW_B2_1) IC3.16(A:SW_B2_2) L6.1
N$132: IC3.51(A:GND_1) R31.1
N$134: IC3.52(A:GND_2) R32.1
N$140: IC3.53(B:GPIO11) R38.1
N$141: IC3.18(B:GPIO7) R35.1
N$142: IC3.41(B:GPIO8) R36.1
N$143: IC3.42(B:GPIO10) R37.1
NERROR_MCU: R35.2 ; also sheet 17
NINT: IC3.14(B:NINT) R41.2 ; also sheet 6,17
NPWRON/ENABLE1: IC3.20(B:NPWRON/ENABLE) R39.1
NRSTOUT: IC3.25(B:NRSTOUT) ; also sheet 6,15
OSC32KCAP: C45.1 IC3.40(B:OSC32KCAP)
OSC32KIN: C43.1 IC3.38(B:OSC32KIN) Y1.1(X1)
OSC32KOUT: C44.1 IC3.39(B:OSC32KOUT) Y1.2(X2)
PMIC_GPIO10: R37.2 ; also sheet 17
PMIC_PGOOD: IC3.19(B:GPIO9) R40.2 ; also sheet 17
PMIC_SCL: IC3.31(B:SCL_I2C1/SCK_SPI) R34.2 ; also sheet 6,7
PMIC_SDA: IC3.30(B:SDA_I2C1/SDI_SPI) R33.2 ; also sheet 6,7
PSAVCC: C47.1 IC3.9(A:VOUT_LDO3) ; also sheet 12
PSAVTT: C46.1 IC3.7(A:VOUT_LDO4) ; also sheet 11,12
VBACKUP: IC3.36(B:VBACKUP) R30.2
VCC_3V3: C33.1 C36.1 C39.1 C41.1 C60.1 C61.1 C63.1 C63.3 C66.1 C66.3 IC3.8(A:PVIN_LDO4) IC3.10(A:PVIN_LDO3) IC3.12(A:PVIN_LDO12) IC3.21(A:FB_B2) L6.2 ; also sheet 11,12,14,15
VCCAUX: C68.1 C70.1 C71.1 C73.1 C74.1 C74.3 C75.1 C75.3 IC3.22(A:FB_B1) L5.2 R40.1 R41.1 ; also sheet 11,12,14,15
VCCINT_EN: IC3.32(B:GPIO1) ; also sheet 7
VCCINT_PG: IC3.33(B:GPIO2) ; also sheet 7,8
VMON: C42.1 IC3.48(B:VIO_IN) R33.1 R34.1 ; also sheet 4,6,7,8,10
VMON_PG: R39.2 ; also sheet 4
VOUT_LDOVINT: C37.1 IC3.2(B:VOUT_LDOVINT)
VOUT_LDOVRTC: C40.1 IC3.3(B:VOUT_LDOVRTC)
WDOG_PWM: R38.2 ; also sheet 17
Unconnected: IC3.1(B:AMUXOUT)

### Notes on the sheet
- PMIC POWER SUPPLY
- 1.8V
- 3.3V
- 3.3V
- 1.8V
- 1V
- 1.2V
- 0.9V
- 0.85V
- 1.8V
- PMIC CONTROL
- 1.8V
- 32.768kHz
- POWER ON SEQUENCE
  
  1. GPIO1 (VCCINT_EN) -> HIGH
  2. GPIO2 (VCCINT_PG) -> WAIT HIGH
  3. BUCK1 (VCCAUX) -> ENABLE
  4. BUCK2 (VCC_3V3) -> ENABLE
  5. LDO2 (MGTAVCC) -> ENABLE
  6. LDO1 (MGTAVTT) -> ENABLE
  7. LDO4 (PSAVTT) -> ENABLE
  8. LDO3 (PSAVCC) -> ENABLE
  9. GPIO3 (DDR4_PWR_EN) -> HIGH
  10. GPIO4 (DDR4_PWR_PG) -> WAIT HIGH
  11. GPIO5 (+2V5_EN) -> HIGH
  12. GPIO6 (+2V5_PG) -> WAIT HIGH
  13. BUCK4 (+1V8) -> ENABLE
  14. BUCK5 (+1V) -> ENABLE
  15. BUCK3 (+3V3) -> ENABLE
  16. NRSTOUT -> HIGH
- I2C Addresses
  * Page 0: 0x24
  * Page 1: 0x25
  * Page 2: 0x26
  * Page 3: 0x27
- VCCAUX | VCC_3V3 | +3V3 | +1V8 | +1V
- BASIC/design/hw_DAA.sch
- Vin | 5V | Vin | 5V | Vin | 5V | Vin | 5V | Vin | 5V
- hw_DAA/BASIC
- Vout | 1.8V | Vout | 3.3V | Vout | 3.3V | Vout | 1.8V | Vout | 1V
- 1010xx
- Iout | 3.5A | Iout | 3.5A | Iout | 3.5A | Iout | 3.5A | Iout | 2A
- jcc5
- Fsw | 4.4MHz | Fsw | 4.4MHz | Fsw | 4.4MHz | Fsw | 4.4MHz | Fsw | 4.4MHz
- dcs7

## Sheet 6 of 34: PMICs Programming
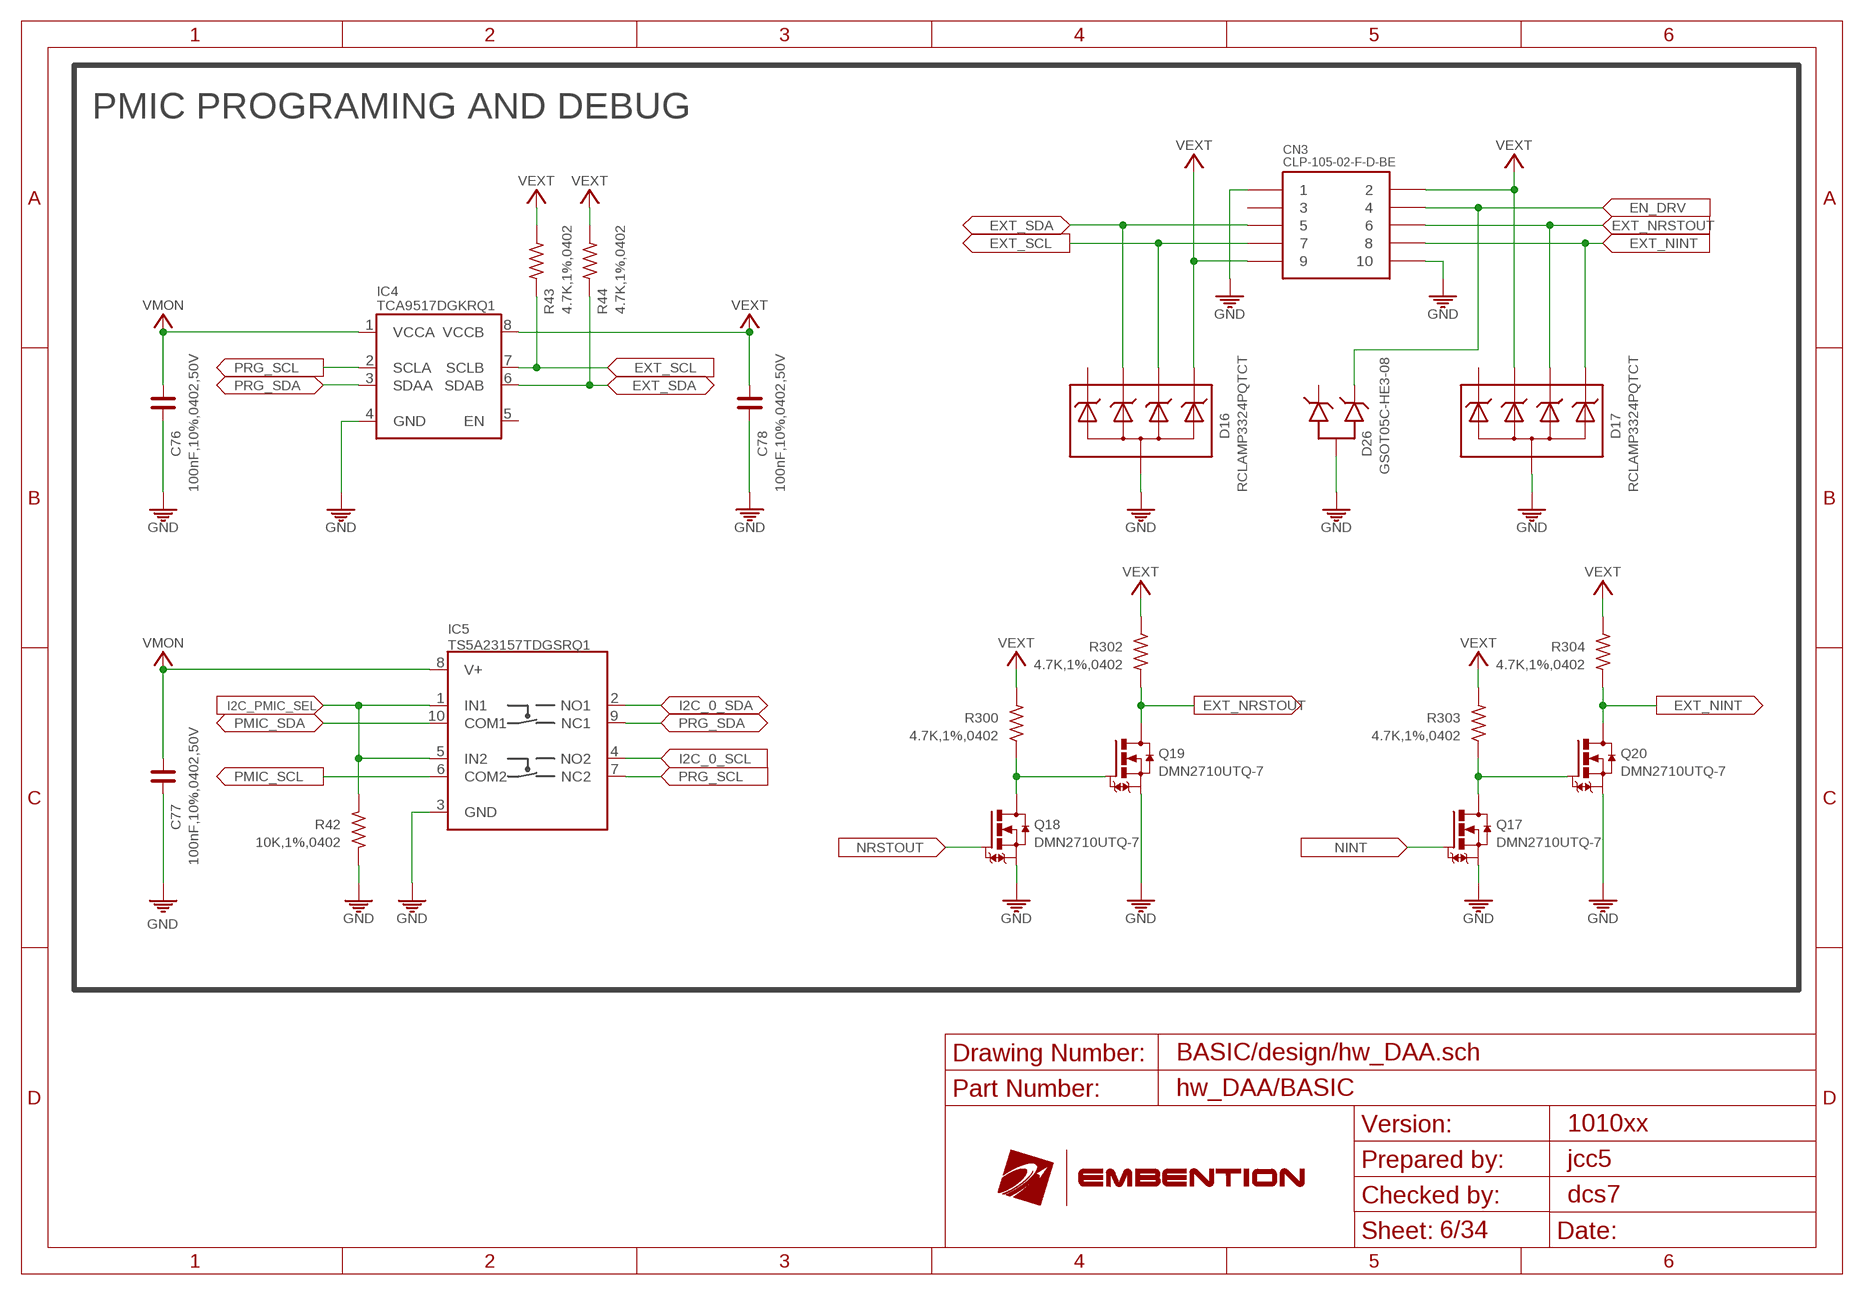
[diagram p5: schematic, sheet 6]

### Parts
C76  100nF,10%,0402,50V  C_0402  [C0402]
C77  100nF,10%,0402,50V  C_0402  [C0402]
C78  100nF,10%,0402,50V  C_0402  [C0402]
CN3  CLP-105-02-F-D-BE  [CLP-105-02-X-D-BE]
D16  RCLAMP3324PQTCT  [USON-10]
D17  RCLAMP3324PQTCT  [USON-10]
D26  GSOT05C-HE3-08  [SOT-23-3]
IC4  TCA9517DGKRQ1  TCA9517-Q1  [VSSOP-8(TEXAS)]
IC5  TS5A23157TDGSRQ1  TS5A23157-Q1  [VSSOP-10]
Q17  DMN2710UTQ-7  [SOT-523]
Q18  DMN2710UTQ-7  [SOT-523]
Q19  DMN2710UTQ-7  [SOT-523]
Q20  DMN2710UTQ-7  [SOT-523]
R42  10K,1%,0402  R_0402  [R0402]
R43  4.7K,1%,0402  R_0402  [R0402]
R44  4.7K,1%,0402  R_0402  [R0402]
R300  4.7K,1%,0402  R_0402  [R0402]
R302  4.7K,1%,0402  R_0402  [R0402]
R303  4.7K,1%,0402  R_0402  [R0402]
R304  4.7K,1%,0402  R_0402  [R0402]

### Nets
EN_DRV: CN3.4 D26.2 ; also sheet 5
EXT_NINT: CN3.8 D17.5 D17.6 Q20.3(D) R304.2
EXT_NRSTOUT: CN3.6 D17.4 D17.7 Q19.3(D) R302.2
EXT_SCL: CN3.7 D16.4 D16.7 IC4.7(SCLB) R43.2
EXT_SDA: CN3.5 D16.2 D16.9 IC4.6(SDAB) R44.2
GND: C76.2 C77.2 C78.2 CN3.1 CN3.10 D16.3 D16.8 D16.38 D17.3 D17.8 D17.38 D26.3 IC4.4(GND) IC5.3(GND) Q17.2(S) Q18.2(S) Q19.2(S) Q20.2(S) R42.1 ; also sheet 2,3,4,5,7,8,9,10,11,12,13,14,15,17,18,20,21,22,23,24,25,26,27,28,29,30,31,32,33
I2C_0_SCL: IC5.4(NO2) ; also sheet 19
I2C_0_SDA: IC5.2(NO1) ; also sheet 19
I2C_PMIC_SEL: IC5.1(IN1) IC5.5(IN2) R42.2 ; also sheet 19
N$58: Q17.3(D) Q20.1(G) R303.2
N$59: Q18.3(D) Q19.1(G) R300.2
NINT: Q17.1(G) ; also sheet 5,17
NRSTOUT: Q18.1(G) ; also sheet 5,15
PMIC_SCL: IC5.6(COM2) ; also sheet 5,7
PMIC_SDA: IC5.10(COM1) ; also sheet 5,7
PRG_SCL: IC4.2(SCLA) IC5.7(NC2)
PRG_SDA: IC4.3(SDAA) IC5.9(NC1)
VEXT: C78.1 CN3.2 CN3.9 D16.5 D16.6 D17.2 D17.9 IC4.8(VCCB) R43.1 R44.1 R300.1 R302.1 R303.1 R304.1
VMON: C76.1 C77.1 IC4.1(VCCA) IC5.8(V+) ; also sheet 4,5,7,8,10
Unconnected: CN3.3 D16.1 D16.10 D17.1 D17.10 D26.1 IC4.5(EN)

### Notes on the sheet
- PMIC PROGRAMING AND DEBUG
- BASIC/design/hw_DAA.sch
- hw_DAA/BASIC
- 1010xx
- jcc5
- dcs7

## Sheet 7 of 34: VCCINT Power Supply
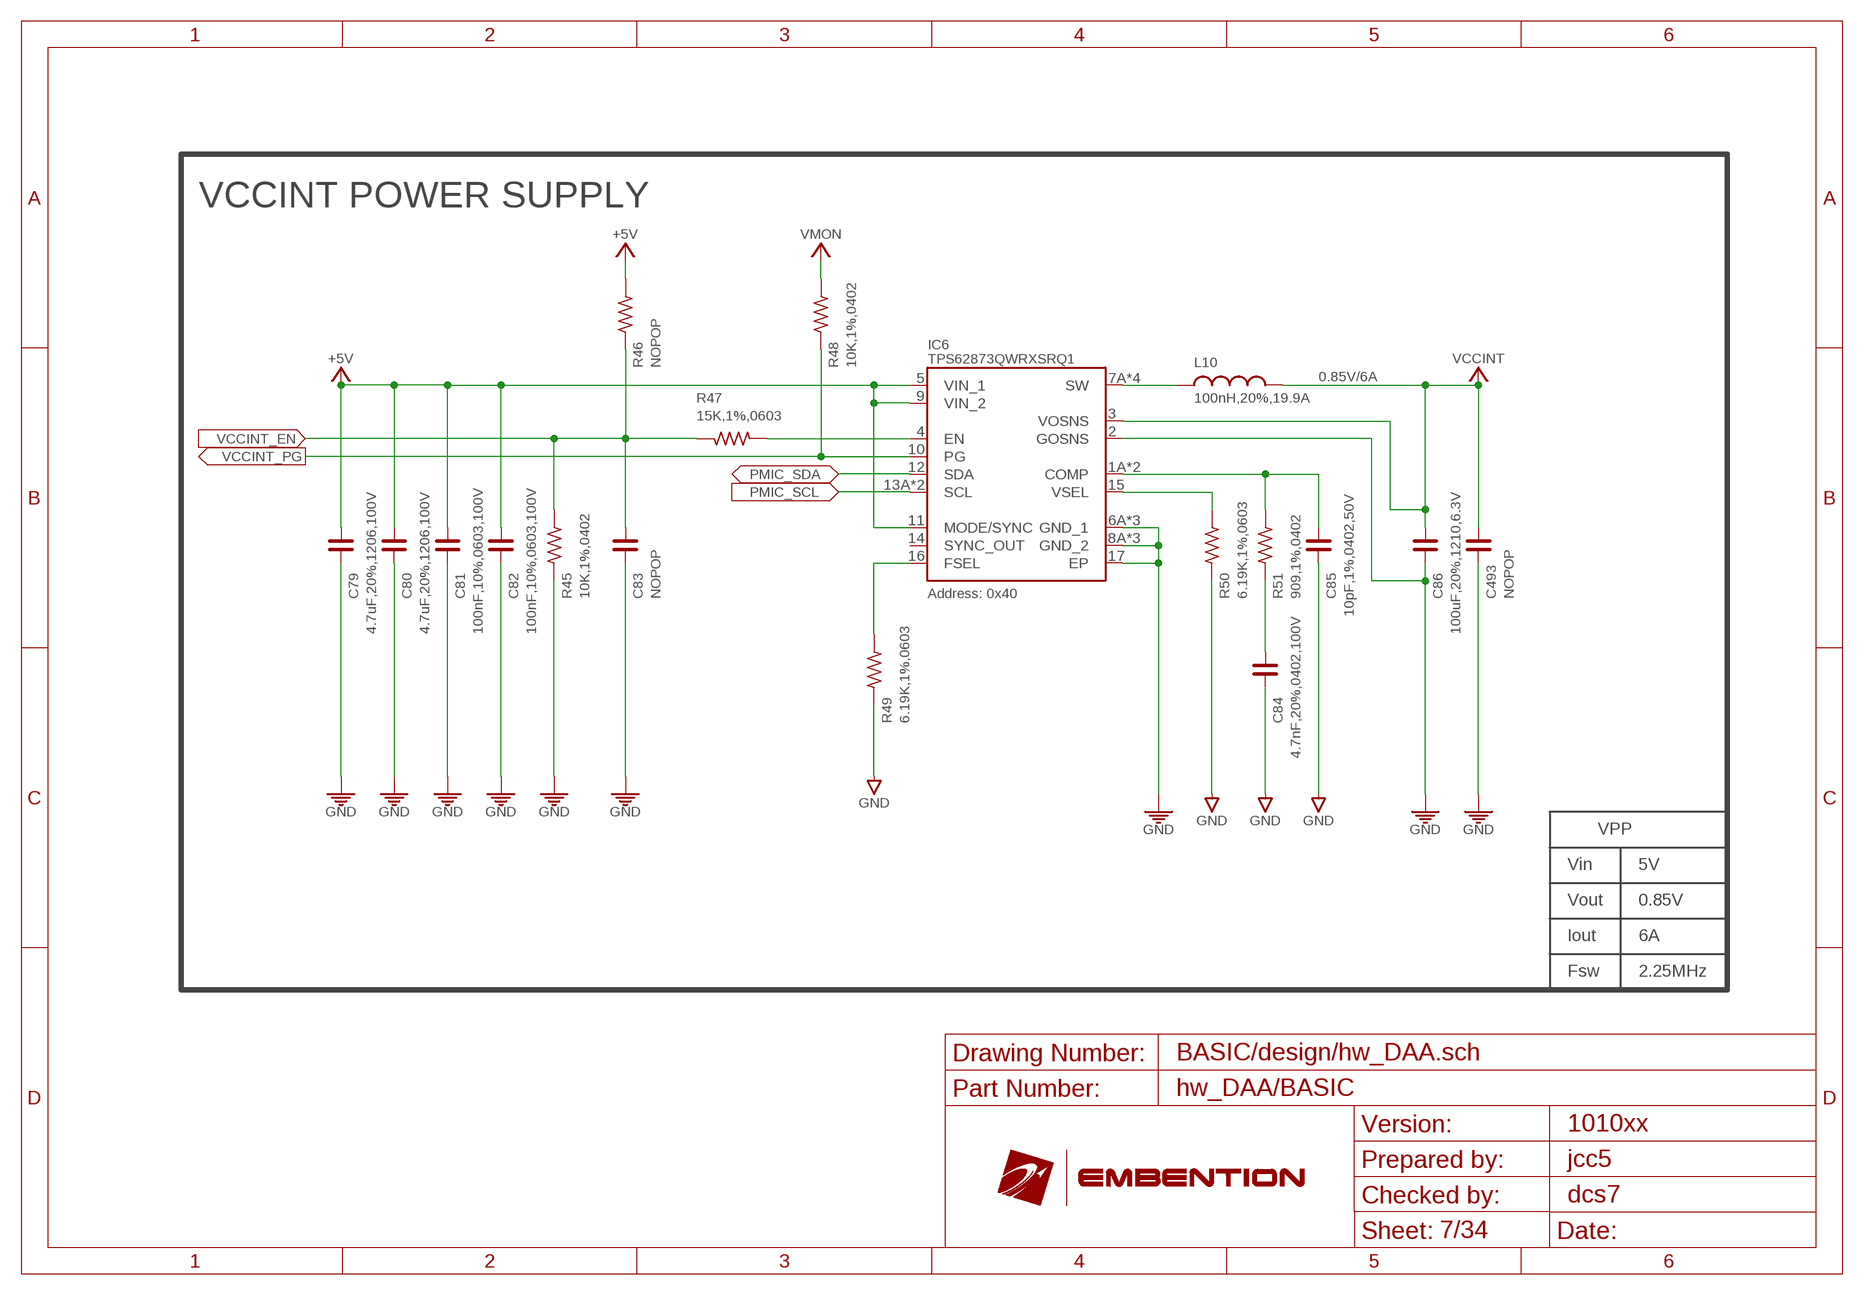
[diagram p6: schematic, sheet 7]

### Parts
C79  4.7uF,20%,1206,100V  C_1206  [C1206]
C80  4.7uF,20%,1206,100V  C_1206  [C1206]
C81  100nF,10%,0603,100V  C_0603  [C0603]
C82  100nF,10%,0603,100V  C_0603  [C0603]
C83  NOPOP  C_0402  [C0402]
C84  4.7nF,20%,0402,100V  C_0402  [C0402]
C85  10pF,1%,0402,50V  C_0402  [C0402]
C86  100uF,20%,1210,6.3V  C_1210  [C1210]
C493  NOPOP  C_1210  [C1210]
IC6  TPS62873QWRXSRQ1  TPS62873-Q1  [VQFN-16_RXS]
L10  100nH,20%,19.9A  XAL4020  [XAL4020]
R45  10K,1%,0402  R_0402  [R0402]
R46  NOPOP  R_0402  [R0402]
R47  15K,1%,0603  R_0603  [R0603]
R48  10K,1%,0402  R_0402  [R0402]
R49  6.19K,1%,0603  R_0603  [R0603]
R50  6.19K,1%,0603  R_0603  [R0603]
R51  909,1%,0402  R_0402  [R0402]

### Nets
+5V: C79.1 C80.1 C81.1 C82.1 IC6.5(VIN_1) IC6.9(VIN_2) IC6.11(MODE/SYNC) R46.2 ; also sheet 3,4,5,8,25,26,33
GND: C79.2 C80.2 C81.2 C82.2 C83.2 C84.2 C85.2 C86.2 C493.2 IC6.2(GOSNS) IC6.6A(GND_1) IC6.6B(GND_1) IC6.6C(GND_1) IC6.8A(GND_2) IC6.8B(GND_2) IC6.8C(GND_2) IC6.17(EP) R45.1 R49.1 R50.1 ; also sheet 2,3,4,5,6,8,9,10,11,12,13,14,15,17,18,20,21,22,23,24,25,26,27,28,29,30,31,32,33
N$71: C85.1 IC6.1A(COMP) IC6.1B(COMP) R51.2
N$72: C84.1 R51.1
N$76: IC6.15(VSEL) R50.2
N$78: IC6.16(FSEL) R49.2
N$99: IC6.7A(SW) IC6.7B(SW) IC6.7C(SW) IC6.7D(SW) L10.1
N$120: IC6.4(EN) R47.2
PMIC_SCL: IC6.13A(SCL) IC6.13B(SCL) ; also sheet 5,6
PMIC_SDA: IC6.12(SDA) ; also sheet 5,6
VCCINT: C86.1 C493.1 IC6.3(VOSNS) L10.2 ; also sheet 11,12,14
VCCINT_EN: C83.1 R45.2 R46.1 R47.1 ; also sheet 5
VCCINT_PG: IC6.10(PG) R48.1 ; also sheet 5,8
VMON: R48.2 ; also sheet 4,5,6,8,10
Unconnected: IC6.14(SYNC_OUT)

### Notes on the sheet
- VCCINT POWER SUPPLY
- 0.85V/6A
- Address: 0x40
- VPP
- Vin | 5V
- Vout | 0.85V
- Iout | 6A
- Fsw | 2.25MHz
- BASIC/design/hw_DAA.sch
- hw_DAA/BASIC
- 1010xx
- jcc5
- dcs7

## Sheet 8 of 34: DDR4 Memories Power Supply
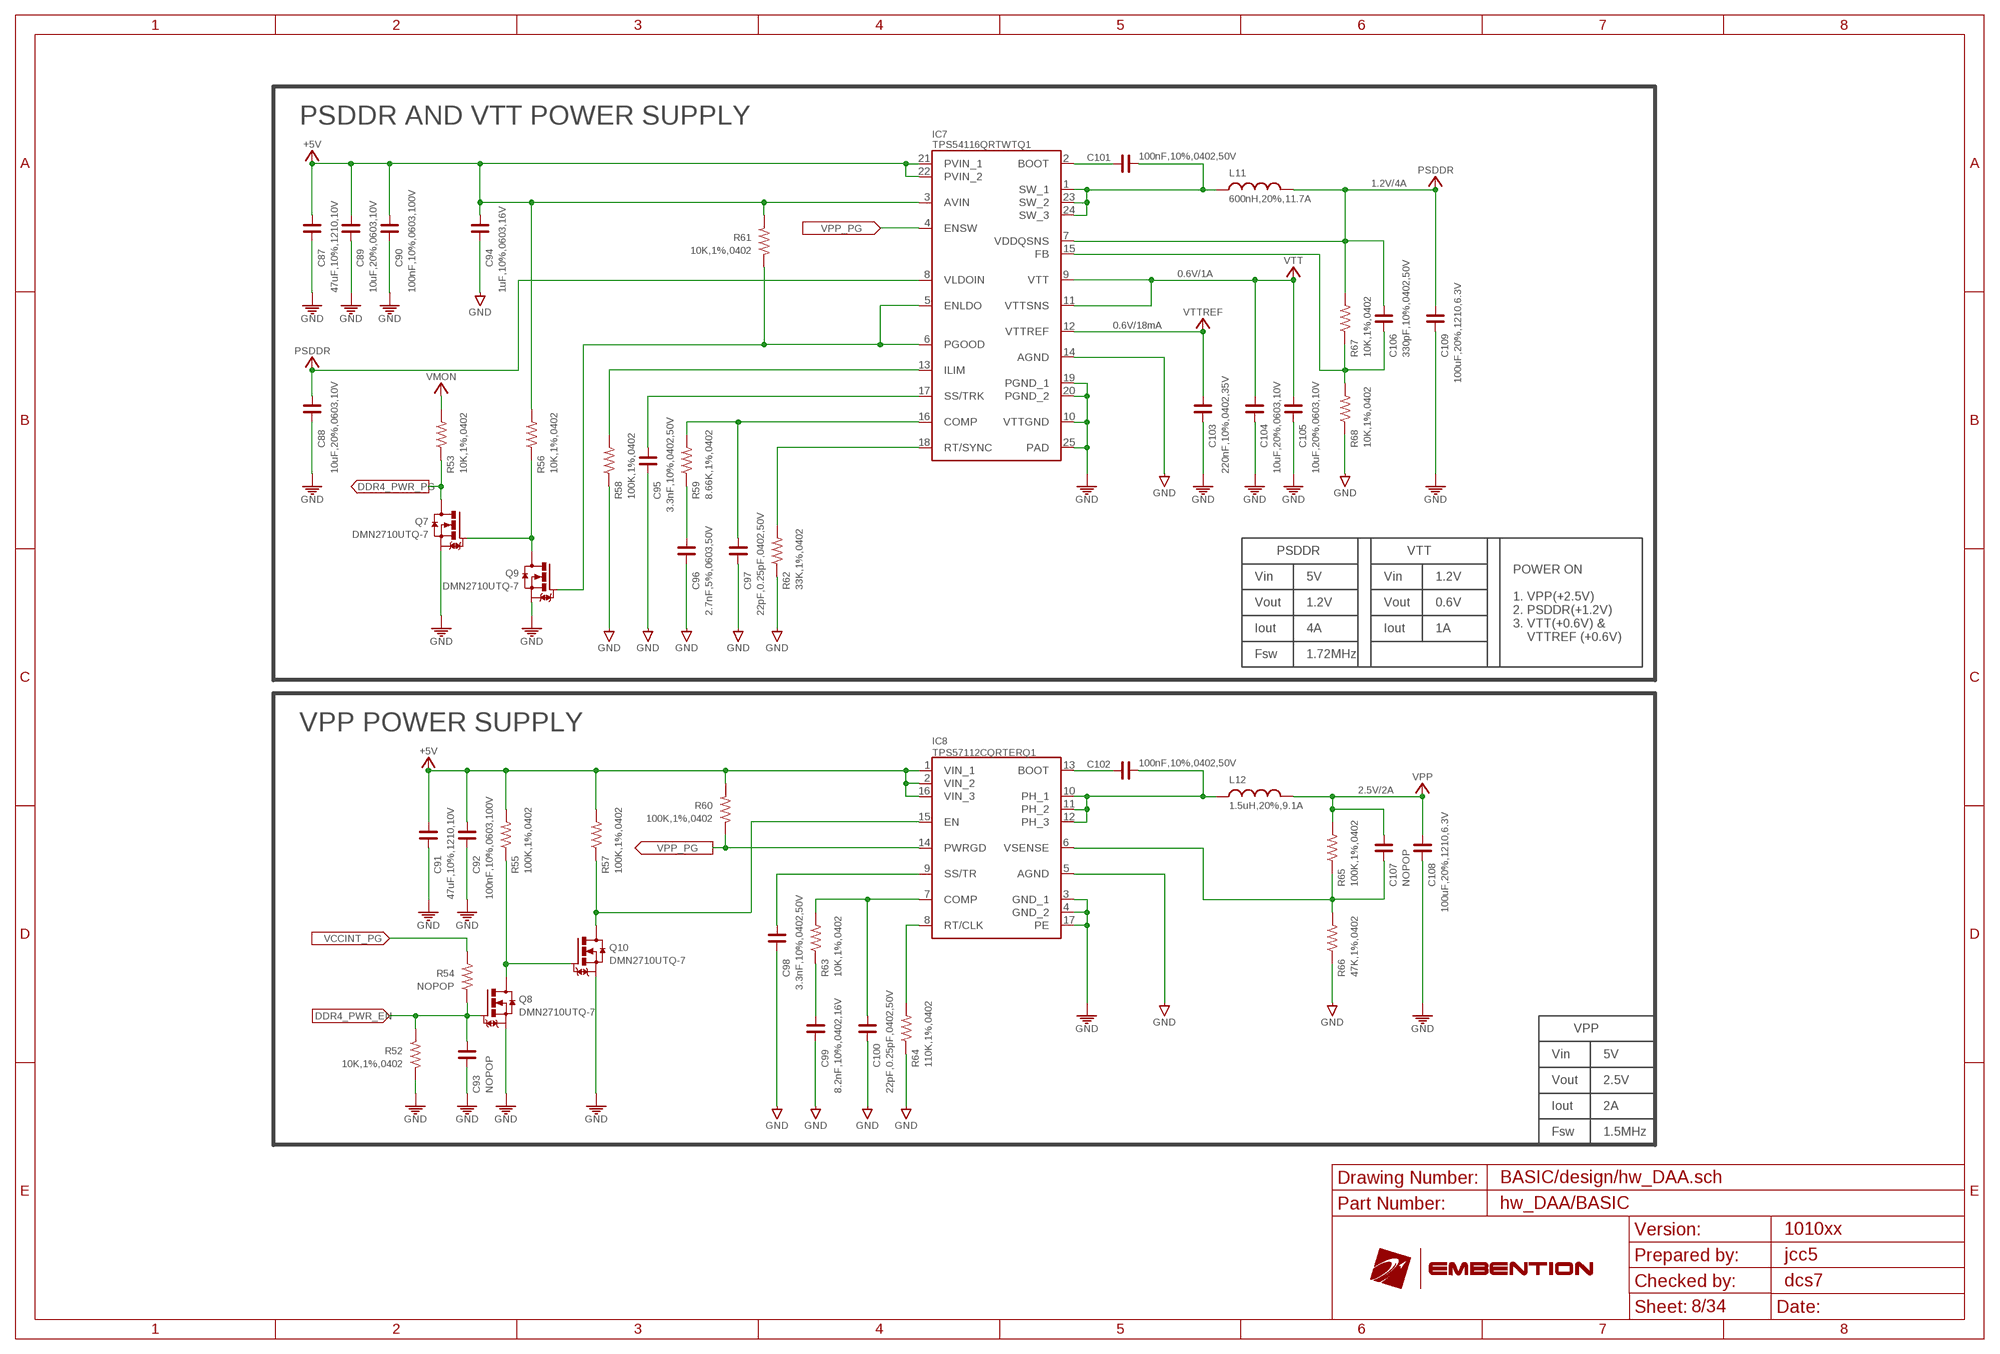
[diagram p7: schematic, sheet 8]

### Parts
C87  47uF,10%,1210,10V  C_1210  [C1210]
C88  10uF,20%,0603,10V  C_0603  [C0603]
C89  10uF,20%,0603,10V  C_0603  [C0603]
C90  100nF,10%,0603,100V  C_0603  [C0603]
C91  47uF,10%,1210,10V  C_1210  [C1210]
C92  100nF,10%,0603,100V  C_0603  [C0603]
C93  NOPOP  C_0402  [C0402]
C94  1uF,10%,0603,16V  C_0603  [C0603]
C95  3.3nF,10%,0402,50V  C_0402  [C0402]
C96  2.7nF,5%,0603,50V  C_0603  [C0603]
C97  22pF,0.25pF,0402,50V  C_0402  [C0402]
C98  3.3nF,10%,0402,50V  C_0402  [C0402]
C99  8.2nF,10%,0402,16V  C_0402  [C0402]
C100  22pF,0.25pF,0402,50V  C_0402  [C0402]
C101  100nF,10%,0402,50V  C_0402  [C0402]
C102  100nF,10%,0402,50V  C_0402  [C0402]
C103  220nF,10%,0402,35V  C_0402  [C0402]
C104  10uF,20%,0603,10V  C_0603  [C0603]
C105  10uF,20%,0603,10V  C_0603  [C0603]
C106  330pF,10%,0402,50V  C_0402  [C0402]
C107  NOPOP  C_0402  [C0402]
C108  100uF,20%,1210,6.3V  C_1210  [C1210]
C109  100uF,20%,1210,6.3V  C_1210  [C1210]
IC7  TPS54116QRTWTQ1  TPS54116-Q1  [WQFN-24]
IC8  TPS57112CQRTERQ1  TPS57112C-Q1  [WQFN-16]
L11  600nH,20%,11.7A  XAL4020  [XAL4020]
L12  1.5uH,20%,9.1A  XAL4020  [XAL4020]
Q7  DMN2710UTQ-7  [SOT-523]
Q8  DMN2710UTQ-7  [SOT-523]
Q9  DMN2710UTQ-7  [SOT-523]
Q10  DMN2710UTQ-7  [SOT-523]
R52  10K,1%,0402  R_0402  [R0402]
R53  10K,1%,0402  R_0402  [R0402]
R54  NOPOP  R_0402  [R0402]
R55  100K,1%,0402  R_0402  [R0402]
R56  10K,1%,0402  R_0402  [R0402]
R57  100K,1%,0402  R_0402  [R0402]
R58  100K,1%,0402  R_0402  [R0402]
R59  8.66K,1%,0402  R_0402  [R0402]
R60  100K,1%,0402  R_0402  [R0402]
R61  10K,1%,0402  R_0402  [R0402]
R62  33K,1%,0402  R_0402  [R0402]
R63  10K,1%,0402  R_0402  [R0402]
R64  110K,1%,0402  R_0402  [R0402]
R65  100K,1%,0402  R_0402  [R0402]
R66  47K,1%,0402  R_0402  [R0402]
R67  10K,1%,0402  R_0402  [R0402]
R68  10K,1%,0402  R_0402  [R0402]

### Nets
+5V: C87.1 C89.1 C90.1 C91.1 C92.1 C94.1 IC7.3(AVIN) IC7.21(PVIN_1) IC7.22(PVIN_2) IC8.1(VIN_1) IC8.2(VIN_2) IC8.16(VIN_3) R55.2 R56.2 R57.2 R60.2 R61.2 ; also sheet 3,4,5,7,25,26,33
DDR4_PWR_EN: C93.1 Q8.1(G) R52.2 R54.1 ; also sheet 5
DDR4_PWR_PG: Q7.3(D) R53.1 ; also sheet 5,10
EN_VPP: IC8.15(EN) Q10.3(D) R57.1
GND: C87.2 C88.2 C89.2 C90.2 C91.2 C92.2 C93.2 C94.2 C95.2 C96.2 C97.2 C98.2 C99.2 C100.2 C103.2 C104.2 C105.2 C108.2 C109.2 IC7.10(VTTGND) IC7.14(AGND) IC7.19(PGND_1) IC7.20(PGND_2) IC7.25(PAD) IC8.3(GND_1) IC8.4(GND_2) IC8.5(AGND) IC8.17(PE) Q7.2(S) Q8.2(S) Q9.2(S) Q10.2(S) R52.1 R58.1 R62.1 R64.1 R66.1 R68.1 ; also sheet 2,3,4,5,6,7,9,10,11,12,13,14,15,17,18,20,21,22,23,24,25,26,27,28,29,30,31,32,33
N$1: C107.2 IC8.6(VSENSE) R65.1 R66.2
N$6: C98.1 IC8.9(SS/TR)
N$7: IC7.13(ILIM) R58.2
N$20: C95.1 IC7.17(SS/TRK)
N$21: C97.1 IC7.16(COMP) R59.2
N$22: C96.1 R59.1
N$23: C100.1 IC8.7(COMP) R63.2
N$24: IC7.18(RT/SYNC) R62.2
N$33: C99.1 R63.1
N$35: IC8.8(RT/CLK) R64.2
N$36: C106.2 IC7.15(FB) R67.1 R68.2
N$38: C102.2 IC8.13(BOOT)
N$39: C101.2 IC7.2(BOOT)
N$40: C101.1 IC7.1(SW_1) IC7.23(SW_2) IC7.24(SW_3) L11.1
N$42: C102.1 IC8.10(PH_1) IC8.11(PH_2) IC8.12(PH_3) L12.1
N$53: Q7.1(G) Q9.3(D) R56.1
N$73: Q8.3(D) Q10.1(G) R55.1
PSDDR: C88.1 C106.1 C109.1 IC7.7(VDDQSNS) IC7.8(VLDOIN) L11.2 R67.2 ; also sheet 12,21,22,23
PSDRR_PG: IC7.5(ENLDO) IC7.6(PGOOD) Q9.1(G) R61.1
VCCINT_PG: R54.2 ; also sheet 5,7
VMON: R53.2 ; also sheet 4,5,6,7,10
VPP: C107.1 C108.1 L12.2 R65.2 ; also sheet 21,22,23
VPP_PG: IC7.4(ENSW) IC8.14(PWRGD) R60.1
VTT: C104.1 C105.1 IC7.9(VTT) IC7.11(VTTSNS) ; also sheet 23
VTTREF: C103.1 IC7.12(VTTREF) ; also sheet 21,22,23

### Notes on the sheet
- PSDDR AND VTT POWER SUPPLY
- 1.2V/4A
- 0.6V/1A
- 0.6V/18mA
- PSDDR | VTT
- Vin | 5V | Vin | 1.2V
- Vout | 1.2V | Vout | 0.6V
- Iout | 4A | Iout | 1A
- POWER ON
  
  1. VPP(+2.5V)
  2. PSDDR(+1.2V)
  3. VTT(+0.6V) &
      VTTREF (+0.6V)
- Fsw | 1.72MHz
- VPP POWER SUPPLY
- 2.5V/2A
- VPP
- Vin | 5V
- Vout | 2.5V
- Iout | 2A
- Fsw | 1.5MHz
- BASIC/design/hw_DAA.sch
- hw_DAA/BASIC
- 1010xx
- jcc5
- dcs7

## Sheet 9 of 34: Image Sensor Power Supply
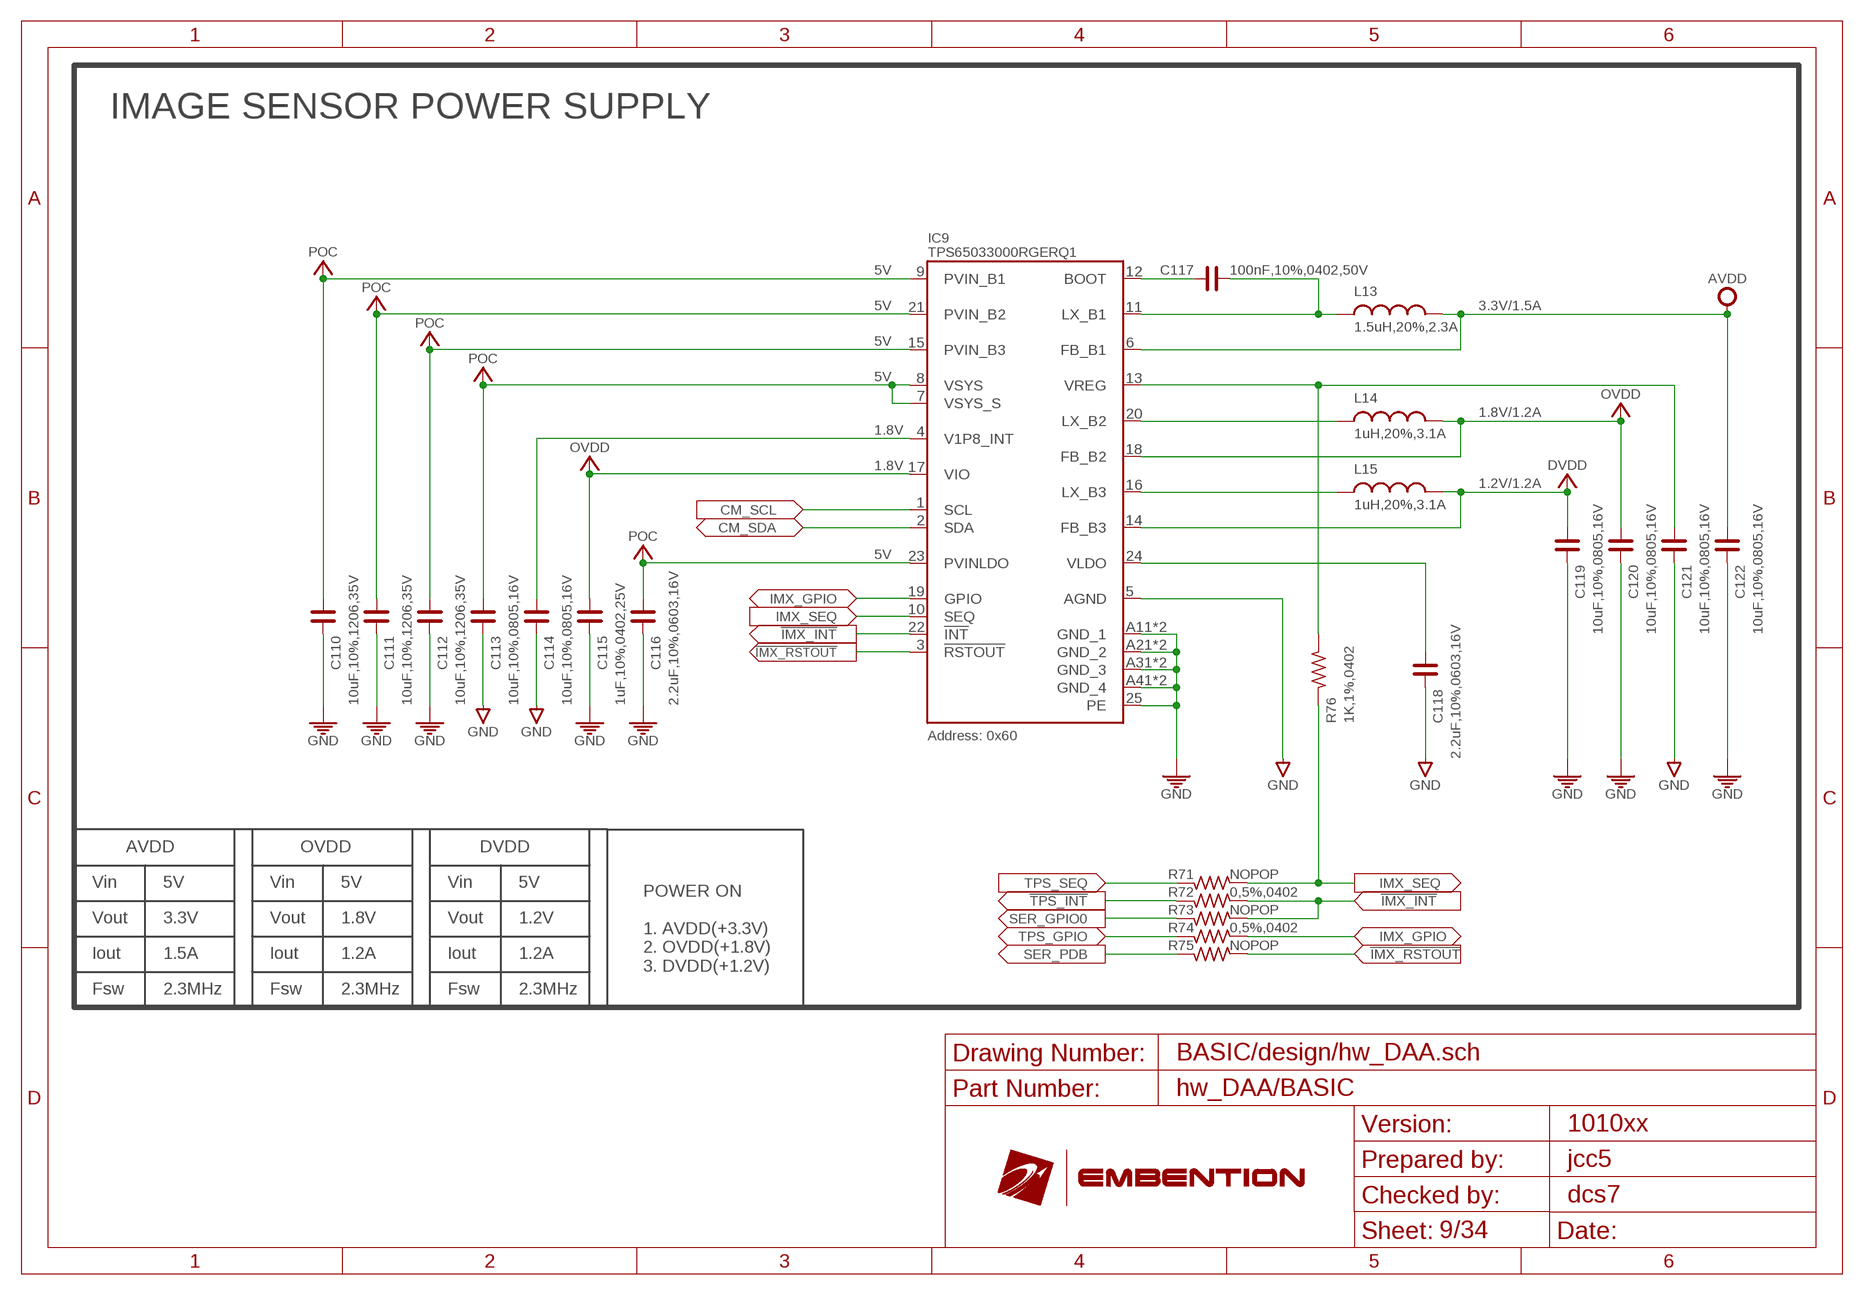
[diagram p8: schematic, sheet 9]

### Parts
C110  10uF,10%,1206,35V  C_1206  [C1206]
C111  10uF,10%,1206,35V  C_1206  [C1206]
C112  10uF,10%,1206,35V  C_1206  [C1206]
C113  10uF,10%,0805,16V  C_0805  [C0805]
C114  10uF,10%,0805,16V  C_0805  [C0805]
C115  1uF,10%,0402,25V  C_0402  [C0402]
C116  2.2uF,10%,0603,16V  C_0603  [C0603]
C117  100nF,10%,0402,50V  C_0402  [C0402]
C118  2.2uF,10%,0603,16V  C_0603  [C0603]
C119  10uF,10%,0805,16V  C_0805  [C0805]
C120  10uF,10%,0805,16V  C_0805  [C0805]
C121  10uF,10%,0805,16V  C_0805  [C0805]
C122  10uF,10%,0805,16V  C_0805  [C0805]
IC9  TPS65033000RGERQ1  TPS650330-Q1  [VQFN-24]
L13  1.5uH,20%,2.3A  L201610  [L201610]
L14  1uH,20%,3.1A  L201610  [L201610]
L15  1uH,20%,3.1A  L201610  [L201610]
R71  NOPOP  R_0402  [R0402]
R72  0,5%,0402  R_0402  [R0402]
R73  NOPOP  R_0402  [R0402]
R74  0,5%,0402  R_0402  [R0402]
R75  NOPOP  R_0402  [R0402]
R76  1K,1%,0402  R_0402  [R0402]

### Nets
!IMX_INT: IC9.22(!INT) R72.1 R73.1
!IMX_RSTOUT: IC9.3(!RSTOUT) R75.1 ; also sheet 28
!TPS_INT: R72.2 ; also sheet 17
+2V8: C118.1 IC9.24(VLDO)
AVDD: C122.1 IC9.6(FB_B1) L13.2 ; also sheet 28,29,30
CM_SCL: IC9.1(SCL) ; also sheet 29
CM_SDA: IC9.2(SDA) ; also sheet 29
DVDD: C119.1 IC9.14(FB_B3) L15.2 ; also sheet 28
GND: C110.2 C111.2 C112.2 C113.2 C114.2 C115.2 C116.2 C118.2 C119.2 C120.2 C121.2 C122.2 IC9.5(AGND) IC9.25(PE) IC9.A11(GND_1) IC9.A12(GND_1) IC9.A21(GND_2) IC9.A22(GND_2) IC9.A31(GND_3) IC9.A32(GND_3) IC9.A41(GND_4) IC9.A42(GND_4) ; also sheet 2,3,4,5,6,7,8,10,11,12,13,14,15,17,18,20,21,22,23,24,25,26,27,28,29,30,31,32,33
IMX_GPIO: IC9.19(GPIO) R74.1
IMX_SEQ: IC9.10(SEQ) R71.1 R76.2
IMX_VREG: C121.1 IC9.13(VREG) R76.1
N$47: IC9.20(LX_B2) L14.1
N$48: IC9.16(LX_B3) L15.1
N$67: C117.2 IC9.12(BOOT)
N$68: C117.1 IC9.11(LX_B1) L13.1
N$115: C114.1 IC9.4(V1P8_INT)
OVDD: C115.1 C120.1 IC9.17(VIO) IC9.18(FB_B2) L14.2 ; also sheet 28,29,30,31,32
POC: C110.1 C111.1 C112.1 C113.1 C116.1 IC9.7(VSYS_S) IC9.8(VSYS) IC9.9(PVIN_B1) IC9.15(PVIN_B3) IC9.21(PVIN_B2) IC9.23(PVINLDO) ; also sheet 2,3
SER_GPIO0: R73.2 ; also sheet 29,31
SER_PDB: R75.2 ; also sheet 31
TPS_GPIO: R74.2 ; also sheet 17
TPS_SEQ: R71.2 ; also sheet 17

### Notes on the sheet
- IMAGE SENSOR POWER SUPPLY
- 5V
- 5V | 3.3V/1.5A
- 5V
- 5V
- 1.8V/1.2A
- 1.8V
- 1.8V
- 1.2V/1.2A
- 5V
- Address: 0x60
- AVDD | OVDD | DVDD
- Vin | 5V | Vin | 5V | Vin | 5V
- Vout | 3.3V | Vout | 1.8V | Vout | 1.2V
- Iout | 1.5A | Iout | 1.2A | Iout | 1.2A
- POWER ON
  
  1. AVDD(+3.3V)
  2. OVDD(+1.8V)
  3. DVDD(+1.2V)
- Fsw | 2.3MHz | Fsw | 2.3MHz | Fsw | 2.3MHz
- BASIC/design/hw_DAA.sch
- hw_DAA/BASIC
- 1010xx
- jcc5
- dcs7

## Sheet 10 of 34: +2V5 Ethernet Power Supply
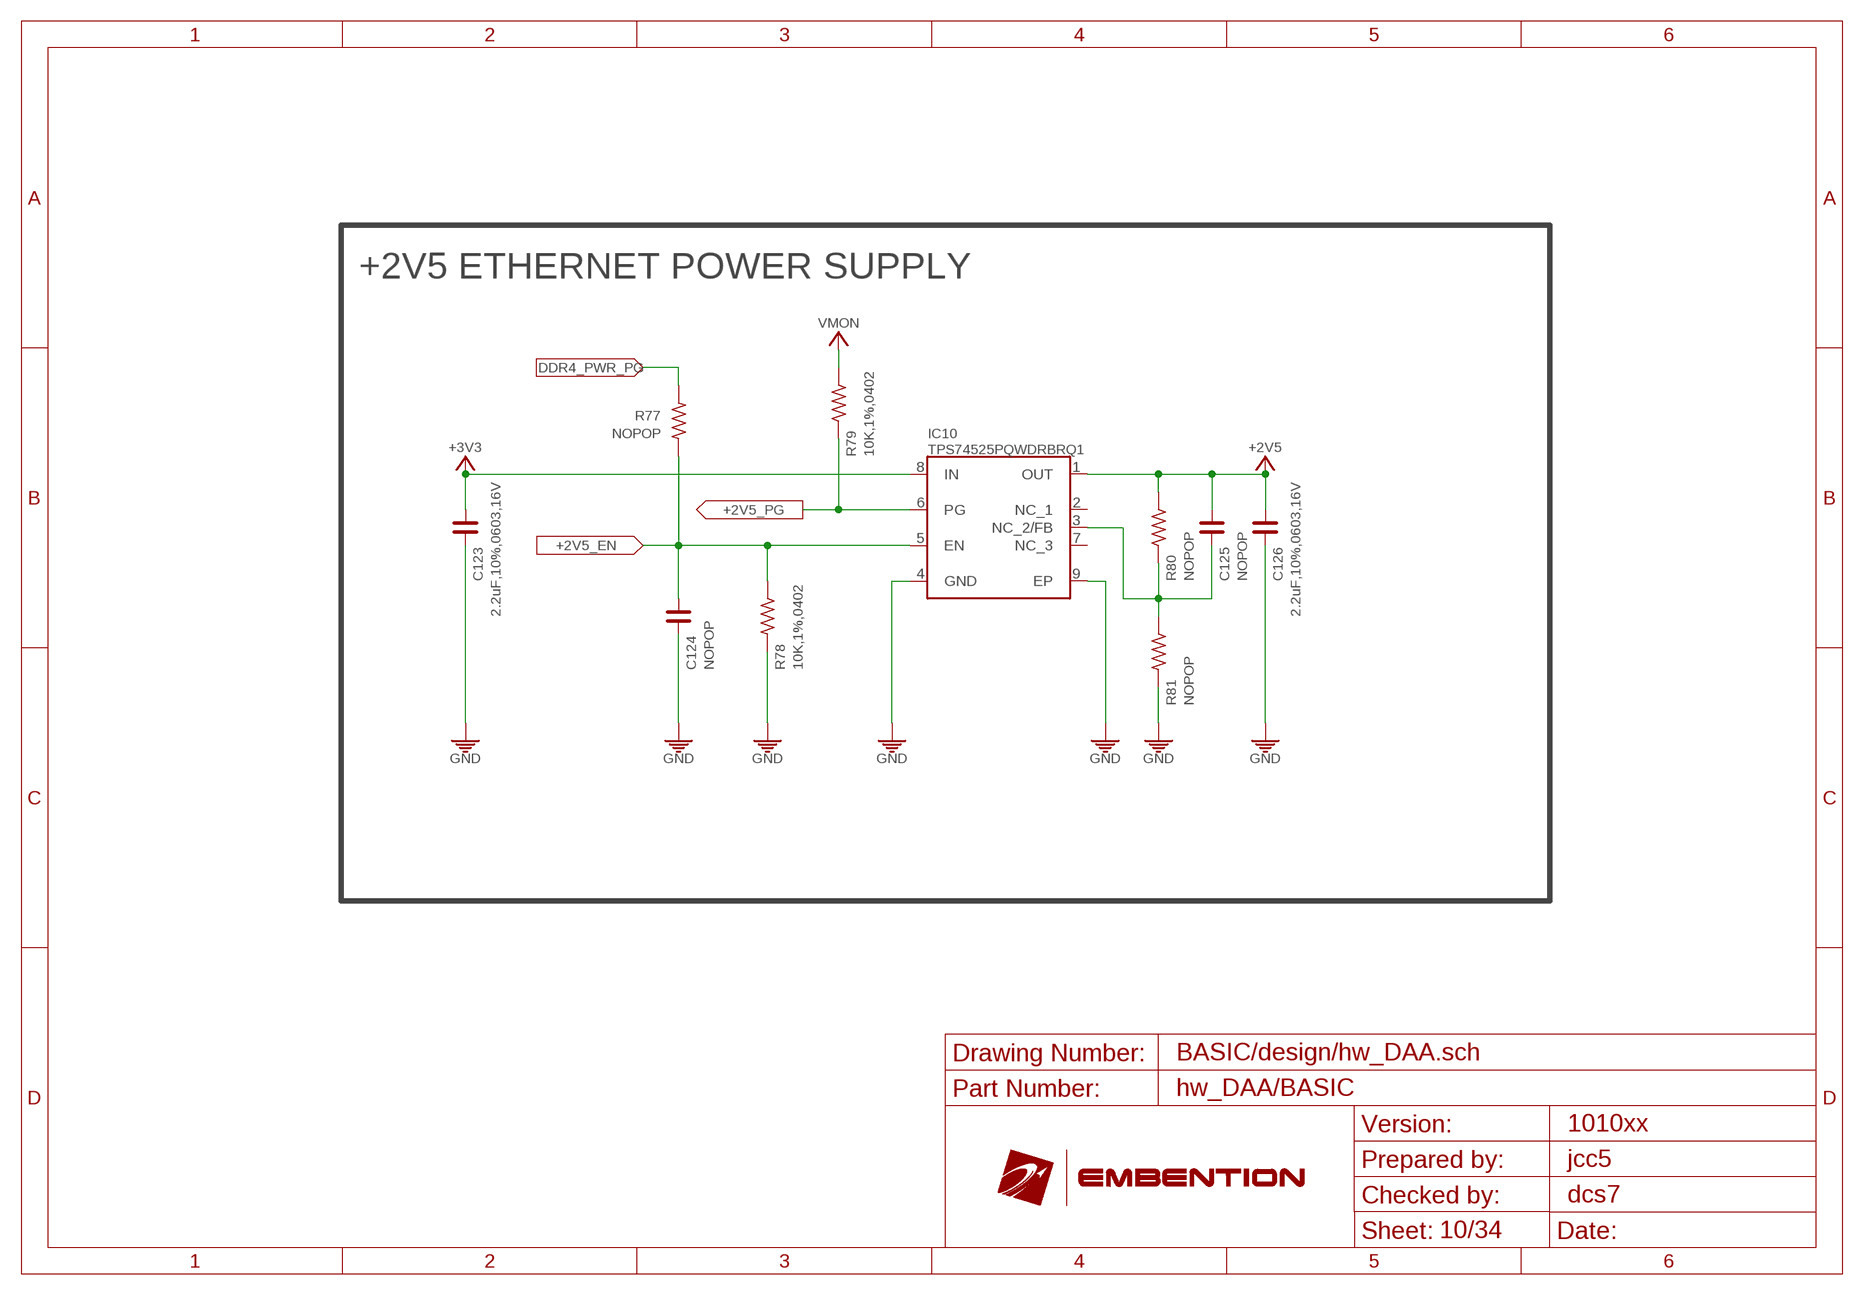
[diagram p9: schematic, sheet 10]

### Parts
C123  2.2uF,10%,0603,16V  C_0603  [C0603]
C124  NOPOP  C_0402  [C0402]
C125  NOPOP  C_0402  [C0402]
C126  2.2uF,10%,0603,16V  C_0603  [C0603]
IC10  TPS74525PQWDRBRQ1  TPS745-Q1  [VSON-8]
R77  NOPOP  R_0402  [R0402]
R78  10K,1%,0402  R_0402  [R0402]
R79  10K,1%,0402  R_0402  [R0402]
R80  NOPOP  R_0402  [R0402]
R81  NOPOP  R_0402  [R0402]

### Nets
+2V5: C125.1 C126.1 IC10.1(OUT) R80.2 ; also sheet 27
+2V5_EN: C124.1 IC10.5(EN) R77.1 R78.2 ; also sheet 5
+2V5_PG: IC10.6(PG) R79.1 ; also sheet 5
+3V3: C123.1 IC10.8(IN) ; also sheet 5,24,25,26
DDR4_PWR_PG: R77.2 ; also sheet 5,8
GND: C123.2 C124.2 C126.2 IC10.4(GND) IC10.9(EP) R78.1 R81.1 ; also sheet 2,3,4,5,6,7,8,9,11,12,13,14,15,17,18,20,21,22,23,24,25,26,27,28,29,30,31,32,33
N$124: C125.2 IC10.3(NC_2/FB) R80.1 R81.2
VMON: R79.2 ; also sheet 4,5,6,7,8
Unconnected: IC10.2(NC_1) IC10.7(NC_3)

### Notes on the sheet
- +2V5 ETHERNET POWER SUPPLY
- BASIC/design/hw_DAA.sch
- hw_DAA/BASIC
- 1010xx
- jcc5
- dcs7

## Sheet 11 of 34: PL Power Supply
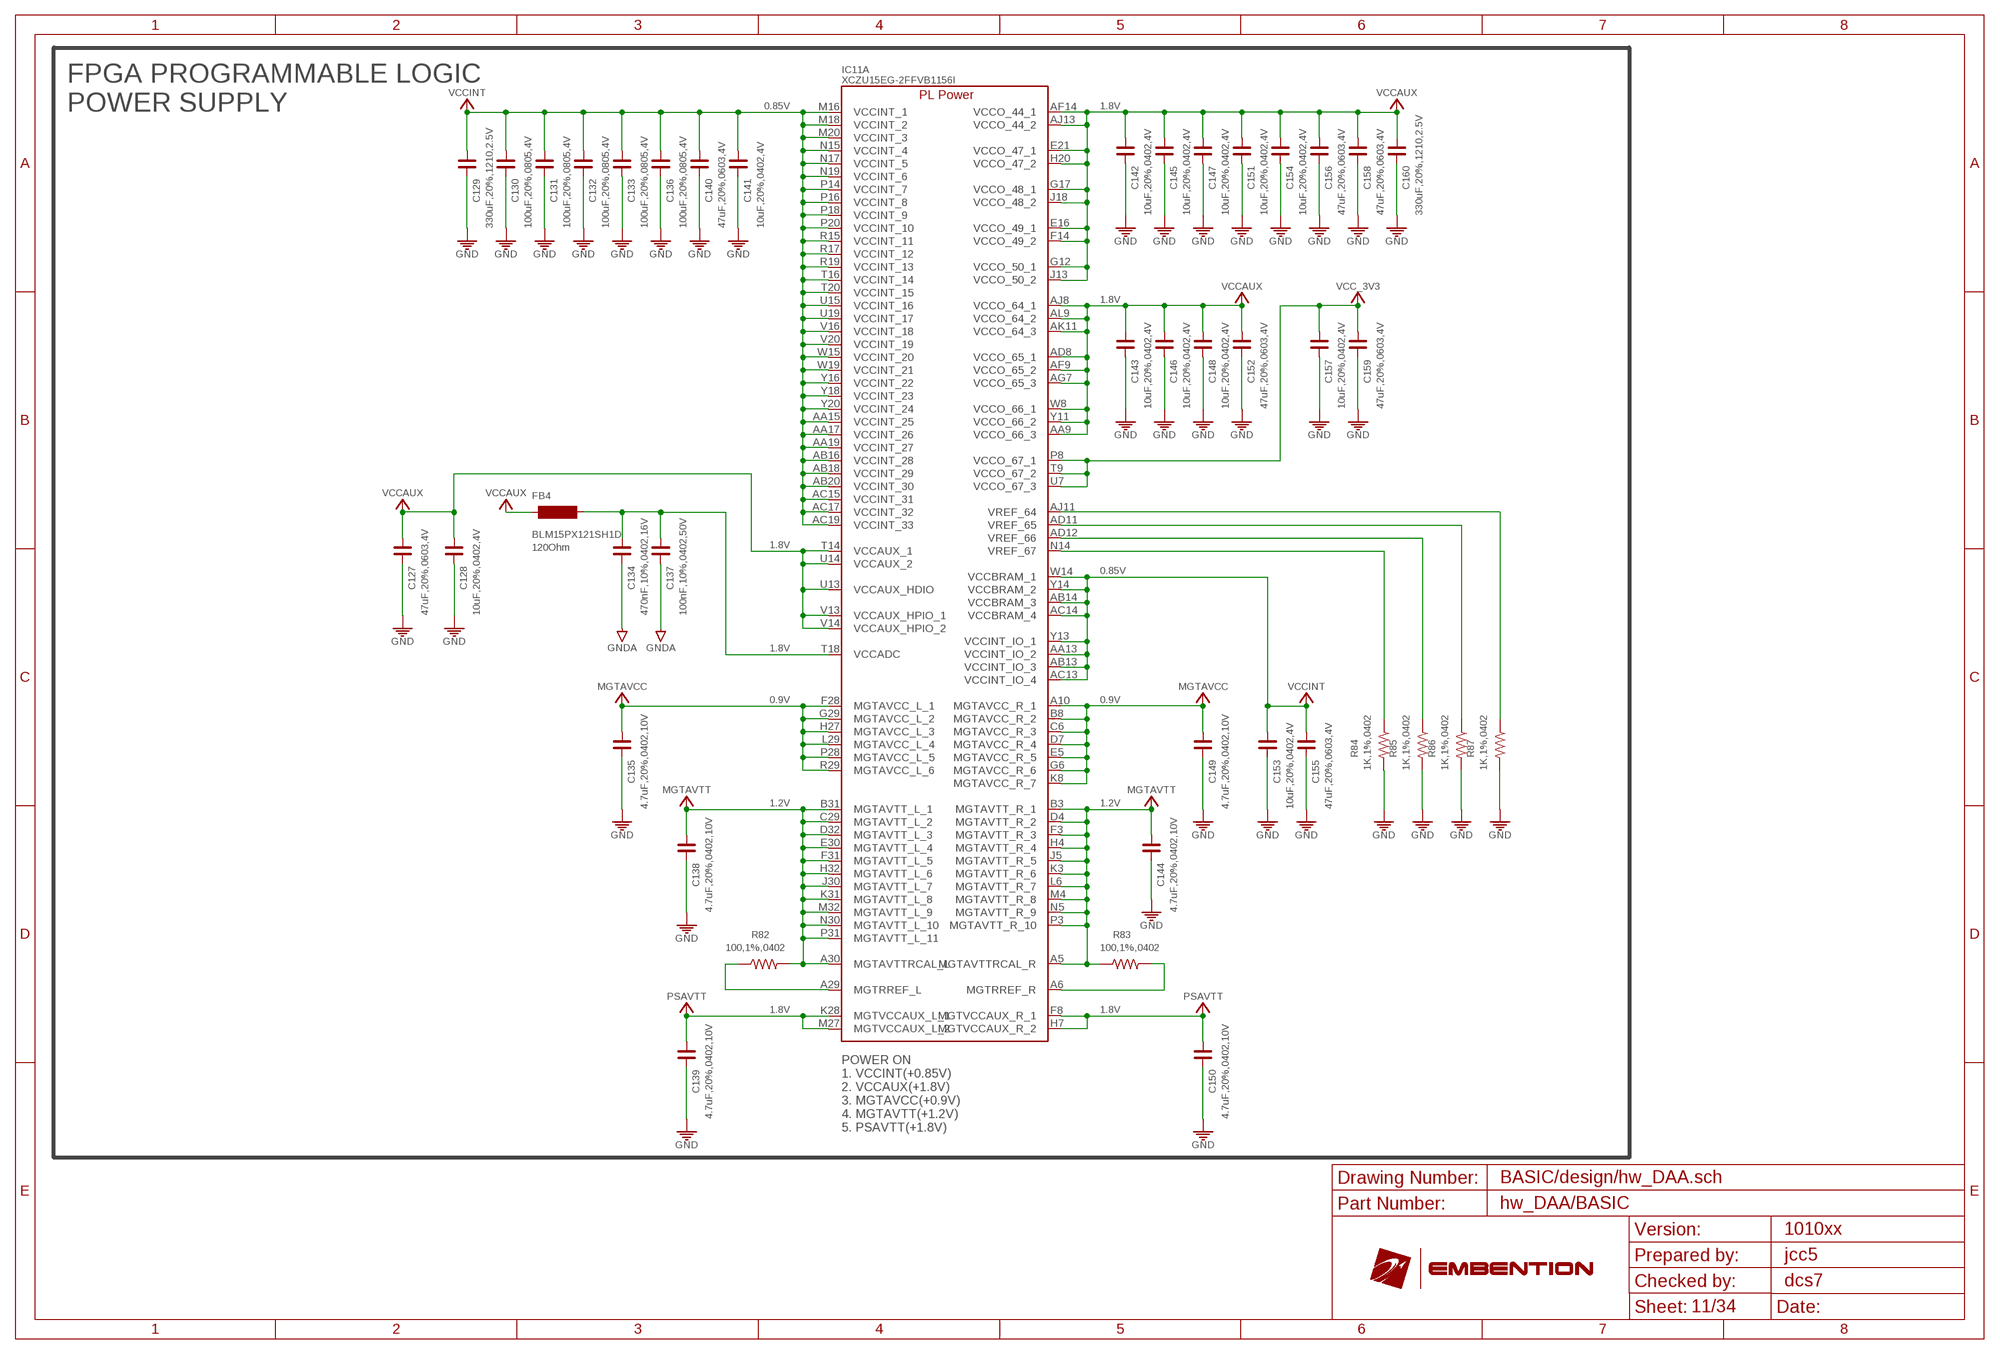
[diagram p10: schematic, sheet 11]

### Parts
C127  47uF,20%,0603,4V  C_0603  [C0603]
C128  10uF,20%,0402,4V  C_0402  [C0402]
C129  330uF,20%,1210,2.5V  C_1210  [C1210]
C130  100uF,20%,0805,4V  C_0805  [C0805]
C131  100uF,20%,0805,4V  C_0805  [C0805]
C132  100uF,20%,0805,4V  C_0805  [C0805]
C133  100uF,20%,0805,4V  C_0805  [C0805]
C134  470nF,10%,0402,16V  C_0402  [C0402]
C135  4.7uF,20%,0402,10V  C_0402  [C0402]
C136  100uF,20%,0805,4V  C_0805  [C0805]
C137  100nF,10%,0402,50V  C_0402  [C0402]
C138  4.7uF,20%,0402,10V  C_0402  [C0402]
C139  4.7uF,20%,0402,10V  C_0402  [C0402]
C140  47uF,20%,0603,4V  C_0603  [C0603]
C141  10uF,20%,0402,4V  C_0402  [C0402]
C142  10uF,20%,0402,4V  C_0402  [C0402]
C143  10uF,20%,0402,4V  C_0402  [C0402]
C144  4.7uF,20%,0402,10V  C_0402  [C0402]
C145  10uF,20%,0402,4V  C_0402  [C0402]
C146  10uF,20%,0402,4V  C_0402  [C0402]
C147  10uF,20%,0402,4V  C_0402  [C0402]
C148  10uF,20%,0402,4V  C_0402  [C0402]
C149  4.7uF,20%,0402,10V  C_0402  [C0402]
C150  4.7uF,20%,0402,10V  C_0402  [C0402]
C151  10uF,20%,0402,4V  C_0402  [C0402]
C152  47uF,20%,0603,4V  C_0603  [C0603]
C153  10uF,20%,0402,4V  C_0402  [C0402]
C154  10uF,20%,0402,4V  C_0402  [C0402]
C155  47uF,20%,0603,4V  C_0603  [C0603]
C156  47uF,20%,0603,4V  C_0603  [C0603]
C157  10uF,20%,0402,4V  C_0402  [C0402]
C158  47uF,20%,0603,4V  C_0603  [C0603]
C159  47uF,20%,0603,4V  C_0603  [C0603]
C160  330uF,20%,1210,2.5V  C_1210  [C1210]
FB4  BLM15PX121SH1D  [L0402]
IC11  XCZU15EG-2FFVB1156I  XCZU15EG-FFVB1156  [FFVB1156_NSMD]
R82  100,1%,0402  R_0402  [R0402]
R83  100,1%,0402  R_0402  [R0402]
R84  1K,1%,0402  R_0402  [R0402]
R85  1K,1%,0402  R_0402  [R0402]
R86  1K,1%,0402  R_0402  [R0402]
R87  1K,1%,0402  R_0402  [R0402]

### Nets
GND: C127.1 C128.1 C129.1 C130.1 C131.1 C132.1 C133.1 C135.1 C136.1 C138.1 C139.1 C140.1 C141.1 C142.1 C143.1 C144.1 C145.1 C146.1 C147.1 C148.1 C149.1 C150.1 C151.1 C152.1 C153.1 C154.1 C155.1 C156.1 C157.1 C158.1 C159.1 C160.1 R84.2 R85.2 R86.2 R87.2 ; also sheet 2,3,4,5,6,7,8,9,10,12,13,14,15,17,18,20,21,22,23,24,25,26,27,28,29,30,31,32,33
GNDA: C134.1 C137.1 ; also sheet 12,13,14
MGTAVCC: C135.2 C149.2 IC11.A10(A:MGTAVCC_R_1) IC11.B8(A:MGTAVCC_R_2) IC11.C6(A:MGTAVCC_R_3) IC11.D7(A:MGTAVCC_R_4) IC11.E5(A:MGTAVCC_R_5) IC11.F28(A:MGTAVCC_L_1) IC11.G6(A:MGTAVCC_R_6) IC11.G29(A:MGTAVCC_L_2) IC11.H27(A:MGTAVCC_L_3) IC11.K8(A:MGTAVCC_R_7) IC11.L29(A:MGTAVCC_L_4) IC11.P28(A:MGTAVCC_L_5) IC11.R29(A:MGTAVCC_L_6) ; also sheet 5
MGTAVTT: C138.2 C144.2 IC11.A5(A:MGTAVTTRCAL_R) IC11.A30(A:MGTAVTTRCAL_L) IC11.B3(A:MGTAVTT_R_1) IC11.B31(A:MGTAVTT_L_1) IC11.C29(A:MGTAVTT_L_2) IC11.D4(A:MGTAVTT_R_2) IC11.D32(A:MGTAVTT_L_3) IC11.E30(A:MGTAVTT_L_4) IC11.F3(A:MGTAVTT_R_3) IC11.F31(A:MGTAVTT_L_5) IC11.H4(A:MGTAVTT_R_4) IC11.H32(A:MGTAVTT_L_6) IC11.J5(A:MGTAVTT_R_5) IC11.J30(A:MGTAVTT_L_7) IC11.K3(A:MGTAVTT_R_6) IC11.K31(A:MGTAVTT_L_8) IC11.L6(A:MGTAVTT_R_7) IC11.M4(A:MGTAVTT_R_8) IC11.M32(A:MGTAVTT_L_9) IC11.N5(A:MGTAVTT_R_9) IC11.N30(A:MGTAVTT_L_10) IC11.P3(A:MGTAVTT_R_10) IC11.P31(A:MGTAVTT_L_11) R82.2 R83.1 ; also sheet 5,12
MGTRREF_L: IC11.A29(A:MGTRREF_L) R82.1
MGTRREF_R: IC11.A6(A:MGTRREF_R) R83.2
PSAVTT: C139.2 C150.2 IC11.F8(A:MGTVCCAUX_R_1) IC11.H7(A:MGTVCCAUX_R_2) IC11.K28(A:MGTVCCAUX_L_1) IC11.M27(A:MGTVCCAUX_L_2) ; also sheet 5,12
VCC_3V3: C157.2 C159.2 IC11.P8(A:VCCO_67_1) IC11.T9(A:VCCO_67_2) IC11.U7(A:VCCO_67_3) ; also sheet 5,12,14,15
VCCADC: C134.2 C137.2 FB4.1 IC11.T18(A:VCCADC)
VCCAUX: C127.2 C128.2 C142.2 C143.2 C145.2 C146.2 C147.2 C148.2 C151.2 C152.2 C154.2 C156.2 C158.2 C160.2 FB4.2 IC11.AA9(A:VCCO_66_3) IC11.AD8(A:VCCO_65_1) IC11.AF9(A:VCCO_65_2) IC11.AF14(A:VCCO_44_1) IC11.AG7(A:VCCO_65_3) IC11.AJ8(A:VCCO_64_1) IC11.AJ13(A:VCCO_44_2) IC11.AK11(A:VCCO_64_3) IC11.AL9(A:VCCO_64_2) IC11.E16(A:VCCO_49_1) IC11.E21(A:VCCO_47_1) IC11.F14(A:VCCO_49_2) IC11.G12(A:VCCO_50_1) IC11.G17(A:VCCO_48_1) IC11.H20(A:VCCO_47_2) IC11.J13(A:VCCO_50_2) IC11.J18(A:VCCO_48_2) IC11.T14(A:VCCAUX_1) IC11.U13(A:VCCAUX_HDIO) IC11.U14(A:VCCAUX_2) IC11.V13(A:VCCAUX_HPIO_1) IC11.V14(A:VCCAUX_HPIO_2) IC11.W8(A:VCCO_66_1) IC11.Y11(A:VCCO_66_2) ; also sheet 5,12,14,15
VCCINT: C129.2 C130.2 C131.2 C132.2 C133.2 C136.2 C140.2 C141.2 C153.2 C155.2 IC11.AA13(A:VCCINT_IO_2) IC11.AA15(A:VCCINT_25) IC11.AA17(A:VCCINT_26) IC11.AA19(A:VCCINT_27) IC11.AB13(A:VCCINT_IO_3) IC11.AB14(A:VCCBRAM_3) IC11.AB16(A:VCCINT_28) IC11.AB18(A:VCCINT_29) IC11.AB20(A:VCCINT_30) IC11.AC13(A:VCCINT_IO_4) IC11.AC14(A:VCCBRAM_4) IC11.AC15(A:VCCINT_31) IC11.AC17(A:VCCINT_32) IC11.AC19(A:VCCINT_33) IC11.M16(A:VCCINT_1) IC11.M18(A:VCCINT_2) IC11.M20(A:VCCINT_3) IC11.N15(A:VCCINT_4) IC11.N17(A:VCCINT_5) IC11.N19(A:VCCINT_6) IC11.P14(A:VCCINT_7) IC11.P16(A:VCCINT_8) IC11.P18(A:VCCINT_9) IC11.P20(A:VCCINT_10) IC11.R15(A:VCCINT_11) IC11.R17(A:VCCINT_12) IC11.R19(A:VCCINT_13) IC11.T16(A:VCCINT_14) IC11.T20(A:VCCINT_15) IC11.U15(A:VCCINT_16) IC11.U19(A:VCCINT_17) IC11.V16(A:VCCINT_18) IC11.V20(A:VCCINT_19) IC11.W14(A:VCCBRAM_1) IC11.W15(A:VCCINT_20) IC11.W19(A:VCCINT_21) IC11.Y13(A:VCCINT_IO_1) IC11.Y14(A:VCCBRAM_2) IC11.Y16(A:VCCINT_22) IC11.Y18(A:VCCINT_23) IC11.Y20(A:VCCINT_24) ; also sheet 7,12,14
VREF_64: IC11.AJ11(A:VREF_64) R87.1
VREF_65: IC11.AD11(A:VREF_65) R86.1
VREF_66: IC11.AD12(A:VREF_66) R85.1
VREF_67: IC11.N14(A:VREF_67) R84.1

### Notes on the sheet
- 0.85V | 1.8V
- FPGA PROGRAMMABLE LOGIC
  POWER SUPPLY
- 1.8V
- 120Ohm | 1.8V
- 0.85V
- 1.8V
- 0.9V | 0.9V
- 1.2V | 1.2V
- 1.8V | 1.8V
- POWER ON
  1. VCCINT(+0.85V)
  2. VCCAUX(+1.8V)
  3. MGTAVCC(+0.9V)
  4. MGTAVTT(+1.2V)
  5. PSAVTT(+1.8V)
- BASIC/design/hw_DAA.sch
- hw_DAA/BASIC
- 1010xx
- jcc5
- dcs7

## Sheet 12 of 34: PS Power Supply
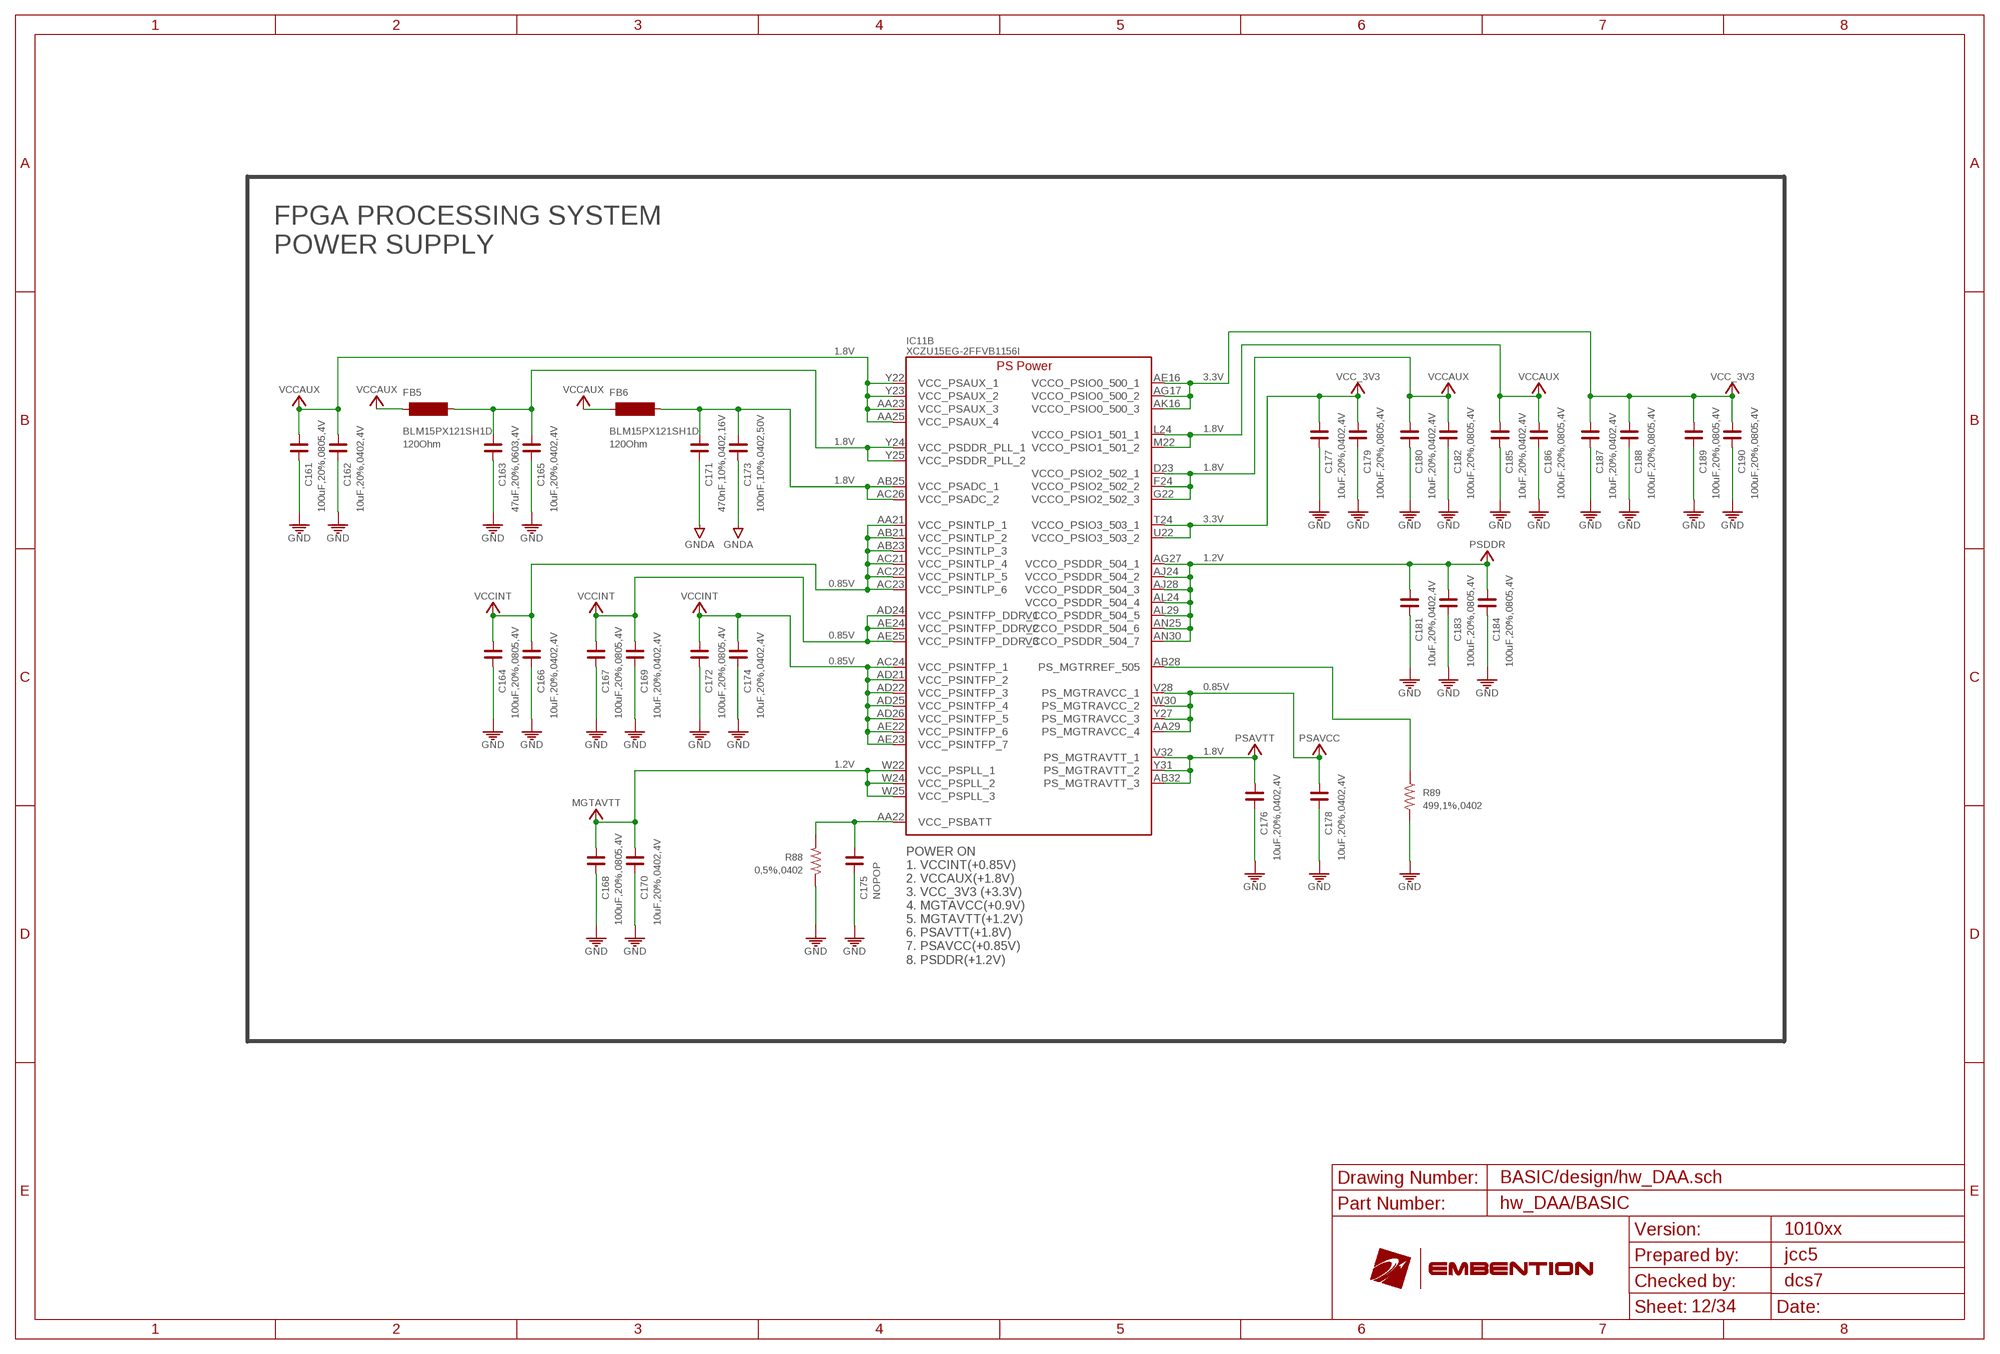
[diagram p11: schematic, sheet 12]

### Parts
C161  100uF,20%,0805,4V  C_0805  [C0805]
C162  10uF,20%,0402,4V  C_0402  [C0402]
C163  47uF,20%,0603,4V  C_0603  [C0603]
C164  100uF,20%,0805,4V  C_0805  [C0805]
C165  10uF,20%,0402,4V  C_0402  [C0402]
C166  10uF,20%,0402,4V  C_0402  [C0402]
C167  100uF,20%,0805,4V  C_0805  [C0805]
C168  100uF,20%,0805,4V  C_0805  [C0805]
C169  10uF,20%,0402,4V  C_0402  [C0402]
C170  10uF,20%,0402,4V  C_0402  [C0402]
C171  470nF,10%,0402,16V  C_0402  [C0402]
C172  100uF,20%,0805,4V  C_0805  [C0805]
C173  100nF,10%,0402,50V  C_0402  [C0402]
C174  10uF,20%,0402,4V  C_0402  [C0402]
C175  NOPOP  C_0402  [C0402]
C176  10uF,20%,0402,4V  C_0402  [C0402]
C177  10uF,20%,0402,4V  C_0402  [C0402]
C178  10uF,20%,0402,4V  C_0402  [C0402]
C179  100uF,20%,0805,4V  C_0805  [C0805]
C180  10uF,20%,0402,4V  C_0402  [C0402]
C181  10uF,20%,0402,4V  C_0402  [C0402]
C182  100uF,20%,0805,4V  C_0805  [C0805]
C183  100uF,20%,0805,4V  C_0805  [C0805]
C184  100uF,20%,0805,4V  C_0805  [C0805]
C185  10uF,20%,0402,4V  C_0402  [C0402]
C186  100uF,20%,0805,4V  C_0805  [C0805]
C187  10uF,20%,0402,4V  C_0402  [C0402]
C188  100uF,20%,0805,4V  C_0805  [C0805]
C189  100uF,20%,0805,4V  C_0805  [C0805]
C190  100uF,20%,0805,4V  C_0805  [C0805]
FB5  BLM15PX121SH1D  [L0402]
FB6  BLM15PX121SH1D  [L0402]
R88  0,5%,0402  R_0402  [R0402]
R89  499,1%,0402  R_0402  [R0402]

### Nets
GND: C161.1 C162.1 C163.1 C164.1 C165.1 C166.1 C167.1 C168.1 C169.1 C170.1 C172.1 C174.1 C175.1 C176.1 C177.1 C178.1 C179.1 C180.1 C181.1 C182.1 C183.1 C184.1 C185.1 C186.1 C187.1 C188.1 C189.1 C190.1 R88.1 R89.2 ; also sheet 2,3,4,5,6,7,8,9,10,11,13,14,15,17,18,20,21,22,23,24,25,26,27,28,29,30,31,32,33
GNDA: C171.1 C173.1 ; also sheet 11,13,14
MGTAVTT: C168.2 C170.2 IC11.W22(B:VCC_PSPLL_1) IC11.W24(B:VCC_PSPLL_2) IC11.W25(B:VCC_PSPLL_3) ; also sheet 5,11
PS_MGTRREF_505: IC11.AB28(B:PS_MGTRREF_505) R89.1
PSAVCC: C178.2 IC11.AA29(B:PS_MGTRAVCC_4) IC11.V28(B:PS_MGTRAVCC_1) IC11.W30(B:PS_MGTRAVCC_2) IC11.Y27(B:PS_MGTRAVCC_3) ; also sheet 5
PSAVTT: C176.2 IC11.AB32(B:PS_MGTRAVTT_3) IC11.V32(B:PS_MGTRAVTT_1) IC11.Y31(B:PS_MGTRAVTT_2) ; also sheet 5,11
PSDDR: C181.2 C183.2 C184.2 IC11.AG27(B:VCCO_PSDDR_504_1) IC11.AJ24(B:VCCO_PSDDR_504_2) IC11.AJ28(B:VCCO_PSDDR_504_3) IC11.AL24(B:VCCO_PSDDR_504_4) IC11.AL29(B:VCCO_PSDDR_504_5) IC11.AN25(B:VCCO_PSDDR_504_6) IC11.AN30(B:VCCO_PSDDR_504_7) ; also sheet 8,21,22,23
VCC_3V3: C177.2 C179.2 C187.2 C188.2 C189.2 C190.2 IC11.AE16(B:VCCO_PSIO0_500_1) IC11.AG17(B:VCCO_PSIO0_500_2) IC11.AK16(B:VCCO_PSIO0_500_3) IC11.T24(B:VCCO_PSIO3_503_1) IC11.U22(B:VCCO_PSIO3_503_2) ; also sheet 5,11,14,15
VCC_PSADC: C171.2 C173.2 FB6.1 IC11.AB25(B:VCC_PSADC_1) IC11.AC26(B:VCC_PSADC_2)
VCC_PSBATT: C175.2 IC11.AA22(B:VCC_PSBATT) R88.2
VCC_PSDDR_PLL: C163.2 C165.2 FB5.1 IC11.Y24(B:VCC_PSDDR_PLL_1) IC11.Y25(B:VCC_PSDDR_PLL_2)
VCCAUX: C161.2 C162.2 C180.2 C182.2 C185.2 C186.2 FB5.2 FB6.2 IC11.AA23(B:VCC_PSAUX_3) IC11.AA25(B:VCC_PSAUX_4) IC11.D23(B:VCCO_PSIO2_502_1) IC11.F24(B:VCCO_PSIO2_502_2) IC11.G22(B:VCCO_PSIO2_502_3) IC11.L24(B:VCCO_PSIO1_501_1) IC11.M22(B:VCCO_PSIO1_501_2) IC11.Y22(B:VCC_PSAUX_1) IC11.Y23(B:VCC_PSAUX_2) ; also sheet 5,11,14,15
VCCINT: C164.2 C166.2 C167.2 C169.2 C172.2 C174.2 IC11.AA21(B:VCC_PSINTLP_1) IC11.AB21(B:VCC_PSINTLP_2) IC11.AB23(B:VCC_PSINTLP_3) IC11.AC21(B:VCC_PSINTLP_4) IC11.AC22(B:VCC_PSINTLP_5) IC11.AC23(B:VCC_PSINTLP_6) IC11.AC24(B:VCC_PSINTFP_1) IC11.AD21(B:VCC_PSINTFP_2) IC11.AD22(B:VCC_PSINTFP_3) IC11.AD24(B:VCC_PSINTFP_DDR_1) IC11.AD25(B:VCC_PSINTFP_4) IC11.AD26(B:VCC_PSINTFP_5) IC11.AE22(B:VCC_PSINTFP_6) IC11.AE23(B:VCC_PSINTFP_7) IC11.AE24(B:VCC_PSINTFP_DDR_2) IC11.AE25(B:VCC_PSINTFP_DDR_3) ; also sheet 7,11,14

### Notes on the sheet
- FPGA PROCESSING SYSTEM
  POWER SUPPLY
- 1.8V
- 3.3V
- 1.8V
- 120Ohm | 120Ohm | 1.8V
- 1.8V
- 1.8V
- 3.3V
- 1.2V
- 0.85V
- 0.85V
- 0.85V
- 0.85V
- 1.8V
- 1.2V
- POWER ON
  1. VCCINT(+0.85V)
  2. VCCAUX(+1.8V)
  3. VCC_3V3 (+3.3V)
  4. MGTAVCC(+0.9V)
  5. MGTAVTT(+1.2V)
  6. PSAVTT(+1.8V)
  7. PSAVCC(+0.85V)
  8. PSDDR(+1.2V)
- BASIC/design/hw_DAA.sch
- hw_DAA/BASIC
- 1010xx
- jcc5
- dcs7

## Sheet 13 of 34: FPGA Ground
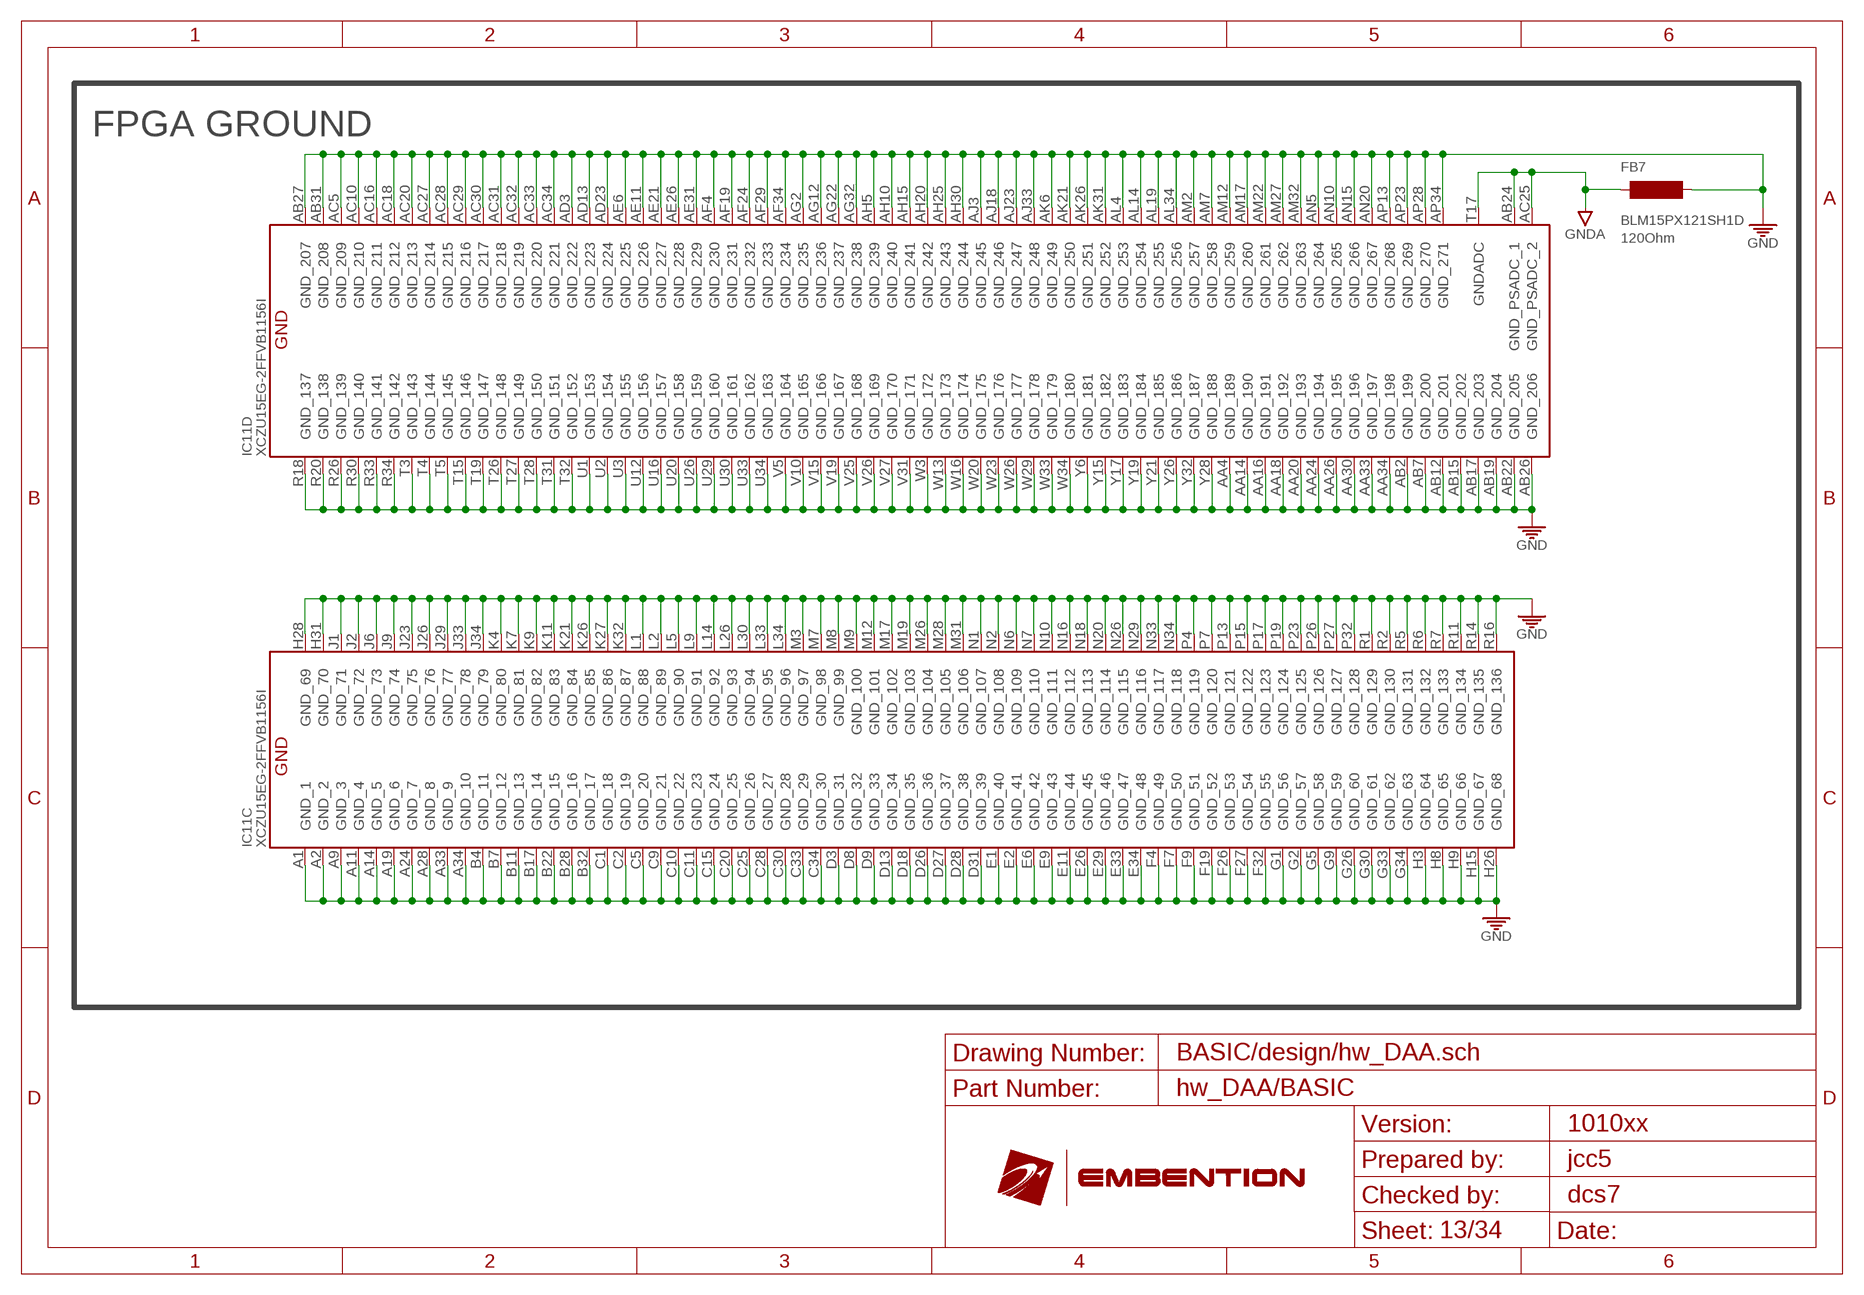
[diagram p12: schematic, sheet 13]

### Parts
FB7  BLM15PX121SH1D  [L0402]

### Nets
GND: FB7.1 IC11.A1(C:GND_1) IC11.A2(C:GND_2) IC11.A9(C:GND_3) IC11.A11(C:GND_4) IC11.A14(C:GND_5) IC11.A19(C:GND_6) IC11.A24(C:GND_7) IC11.A28(C:GND_8) IC11.A33(C:GND_9) IC11.A34(C:GND_10) IC11.AA4(D:GND_189) IC11.AA14(D:GND_190) IC11.AA16(D:GND_191) IC11.AA18(D:GND_192) IC11.AA20(D:GND_193) IC11.AA24(D:GND_194) IC11.AA26(D:GND_195) IC11.AA30(D:GND_196) IC11.AA33(D:GND_197) IC11.AA34(D:GND_198) IC11.AB2(D:GND_199) IC11.AB7(D:GND_200) IC11.AB12(D:GND_201) IC11.AB15(D:GND_202) IC11.AB17(D:GND_203) IC11.AB19(D:GND_204) IC11.AB22(D:GND_205) IC11.AB26(D:GND_206) IC11.AB27(D:GND_207) IC11.AB31(D:GND_208) IC11.AC5(D:GND_209) IC11.AC10(D:GND_210) IC11.AC16(D:GND_211) IC11.AC18(D:GND_212) IC11.AC20(D:GND_213) IC11.AC27(D:GND_214) IC11.AC28(D:GND_215) IC11.AC29(D:GND_216) IC11.AC30(D:GND_217) IC11.AC31(D:GND_218) IC11.AC32(D:GND_219) IC11.AC33(D:GND_220) IC11.AC34(D:GND_221) IC11.AD3(D:GND_222) IC11.AD13(D:GND_223) IC11.AD23(D:GND_224) IC11.AE6(D:GND_225) IC11.AE11(D:GND_226) IC11.AE21(D:GND_227) IC11.AE26(D:GND_228) IC11.AE31(D:GND_229) IC11.AF4(D:GND_230) IC11.AF19(D:GND_231) IC11.AF24(D:GND_232) IC11.AF29(D:GND_233) IC11.AF34(D:GND_234) IC11.AG2(D:GND_235) IC11.AG12(D:GND_236) IC11.AG22(D:GND_237) IC11.AG32(D:GND_238) IC11.AH5(D:GND_239) IC11.AH10(D:GND_240) IC11.AH15(D:GND_241) IC11.AH20(D:GND_242) IC11.AH25(D:GND_243) IC11.AH30(D:GND_244) IC11.AJ3(D:GND_245) IC11.AJ18(D:GND_246) IC11.AJ23(D:GND_247) IC11.AJ33(D:GND_248) IC11.AK6(D:GND_249) IC11.AK21(D:GND_250) IC11.AK26(D:GND_251) IC11.AK31(D:GND_252) IC11.AL4(D:GND_253) IC11.AL14(D:GND_254) IC11.AL19(D:GND_255) IC11.AL34(D:GND_256) IC11.AM2(D:GND_257) IC11.AM7(D:GND_258) IC11.AM12(D:GND_259) IC11.AM17(D:GND_260) IC11.AM22(D:GND_261) IC11.AM27(D:GND_262) IC11.AM32(D:GND_263) IC11.AN5(D:GND_264) IC11.AN10(D:GND_265) IC11.AN15(D:GND_266) IC11.AN20(D:GND_267) IC11.AP13(D:GND_268) IC11.AP23(D:GND_269) IC11.AP28(D:GND_270) IC11.AP34(D:GND_271) IC11.B4(C:GND_11) IC11.B7(C:GND_12) IC11.B11(C:GND_13) IC11.B17(C:GND_14) IC11.B22(C:GND_15) IC11.B28(C:GND_16) IC11.B32(C:GND_17) IC11.C1(C:GND_18) IC11.C2(C:GND_19) IC11.C5(C:GND_20) IC11.C9(C:GND_21) IC11.C10(C:GND_22) IC11.C11(C:GND_23) IC11.C15(C:GND_24) IC11.C20(C:GND_25) IC11.C25(C:GND_26) IC11.C28(C:GND_27) IC11.C30(C:GND_28) IC11.C33(C:GND_29) IC11.C34(C:GND_30) IC11.D3(C:GND_31) IC11.D8(C:GND_32) IC11.D9(C:GND_33) IC11.D13(C:GND_34) IC11.D18(C:GND_35) IC11.D26(C:GND_36) IC11.D27(C:GND_37) IC11.D28(C:GND_38) IC11.D31(C:GND_39) IC11.E1(C:GND_40) IC11.E2(C:GND_41) IC11.E6(C:GND_42) IC11.E9(C:GND_43) IC11.E11(C:GND_44) IC11.E26(C:GND_45) IC11.E29(C:GND_46) IC11.E33(C:GND_47) IC11.E34(C:GND_48) IC11.F4(C:GND_49) IC11.F7(C:GND_50) IC11.F9(C:GND_51) IC11.F19(C:GND_52) IC11.F26(C:GND_53) IC11.F27(C:GND_54) IC11.F32(C:GND_55) IC11.G1(C:GND_56) IC11.G2(C:GND_57) IC11.G5(C:GND_58) IC11.G9(C:GND_59) IC11.G26(C:GND_60) IC11.G30(C:GND_61) IC11.G33(C:GND_62) IC11.G34(C:GND_63) IC11.H3(C:GND_64) IC11.H8(C:GND_65) IC11.H9(C:GND_66) IC11.H15(C:GND_67) IC11.H26(C:GND_68) IC11.H28(C:GND_69) IC11.H31(C:GND_70) IC11.J1(C:GND_71) IC11.J2(C:GND_72) IC11.J6(C:GND_73) IC11.J9(C:GND_74) IC11.J23(C:GND_75) IC11.J26(C:GND_76) IC11.J29(C:GND_77) IC11.J33(C:GND_78) IC11.J34(C:GND_79) IC11.K4(C:GND_80) IC11.K7(C:GND_81) IC11.K9(C:GND_82) IC11.K11(C:GND_83) IC11.K21(C:GND_84) IC11.K26(C:GND_85) IC11.K27(C:GND_86) IC11.K32(C:GND_87) IC11.L1(C:GND_88) IC11.L2(C:GND_89) IC11.L5(C:GND_90) IC11.L9(C:GND_91) IC11.L14(C:GND_92) IC11.L26(C:GND_93) IC11.L30(C:GND_94) IC11.L33(C:GND_95) IC11.L34(C:GND_96) IC11.M3(C:GND_97) IC11.M7(C:GND_98) IC11.M8(C:GND_99) IC11.M9(C:GND_100) IC11.M12(C:GND_101) IC11.M17(C:GND_102) IC11.M19(C:GND_103) IC11.M26(C:GND_104) IC11.M28(C:GND_105) IC11.M31(C:GND_106) IC11.N1(C:GND_107) IC11.N2(C:GND_108) IC11.N6(C:GND_109) IC11.N7(C:GND_110) IC11.N10(C:GND_111) IC11.N16(C:GND_112) IC11.N18(C:GND_113) IC11.N20(C:GND_114) IC11.N26(C:GND_115) IC11.N29(C:GND_116) IC11.N33(C:GND_117) IC11.N34(C:GND_118) IC11.P4(C:GND_119) IC11.P7(C:GND_120) IC11.P13(C:GND_121) IC11.P15(C:GND_122) IC11.P17(C:GND_123) IC11.P19(C:GND_124) IC11.P23(C:GND_125) IC11.P26(C:GND_126) IC11.P27(C:GND_127) IC11.P32(C:GND_128) IC11.R1(C:GND_129) IC11.R2(C:GND_130) IC11.R5(C:GND_131) IC11.R6(C:GND_132) IC11.R7(C:GND_133) IC11.R11(C:GND_134) IC11.R14(C:GND_135) IC11.R16(C:GND_136) IC11.R18(D:GND_137) IC11.R20(D:GND_138) IC11.R26(D:GND_139) IC11.R30(D:GND_140) IC11.R33(D:GND_141) IC11.R34(D:GND_142) IC11.T3(D:GND_143) IC11.T4(D:GND_144) IC11.T5(D:GND_145) IC11.T15(D:GND_146) IC11.T19(D:GND_147) IC11.T26(D:GND_148) IC11.T27(D:GND_149) IC11.T28(D:GND_150) IC11.T31(D:GND_151) IC11.T32(D:GND_152) IC11.U1(D:GND_153) IC11.U2(D:GND_154) IC11.U3(D:GND_155) IC11.U12(D:GND_156) IC11.U16(D:GND_157) IC11.U20(D:GND_158) IC11.U26(D:GND_159) IC11.U29(D:GND_160) IC11.U30(D:GND_161) IC11.U33(D:GND_162) IC11.U34(D:GND_163) IC11.V5(D:GND_164) IC11.V10(D:GND_165) IC11.V15(D:GND_166) IC11.V19(D:GND_167) IC11.V25(D:GND_168) IC11.V26(D:GND_169) IC11.V27(D:GND_170) IC11.V31(D:GND_171) IC11.W3(D:GND_172) IC11.W13(D:GND_173) IC11.W16(D:GND_174) IC11.W20(D:GND_175) IC11.W23(D:GND_176) IC11.W26(D:GND_177) IC11.W29(D:GND_178) IC11.W33(D:GND_179) IC11.W34(D:GND_180) IC11.Y6(D:GND_181) IC11.Y15(D:GND_182) IC11.Y17(D:GND_183) IC11.Y19(D:GND_184) IC11.Y21(D:GND_185) IC11.Y26(D:GND_186) IC11.Y28(D:GND_188) IC11.Y32(D:GND_187) ; also sheet 2,3,4,5,6,7,8,9,10,11,12,14,15,17,18,20,21,22,23,24,25,26,27,28,29,30,31,32,33
GNDA: FB7.2 IC11.AB24(D:GND_PSADC_1) IC11.AC25(D:GND_PSADC_2) IC11.T17(D:GNDADC) ; also sheet 11,12,14

### Notes on the sheet
- FPGA GROUND
- 120Ohm
- BASIC/design/hw_DAA.sch
- hw_DAA/BASIC
- 1010xx
- jcc5
- dcs7